# EAGLE schematic Welder_PSU (EAGLE 9.6.2), part 1 of 2

## Sheet 1 of 5
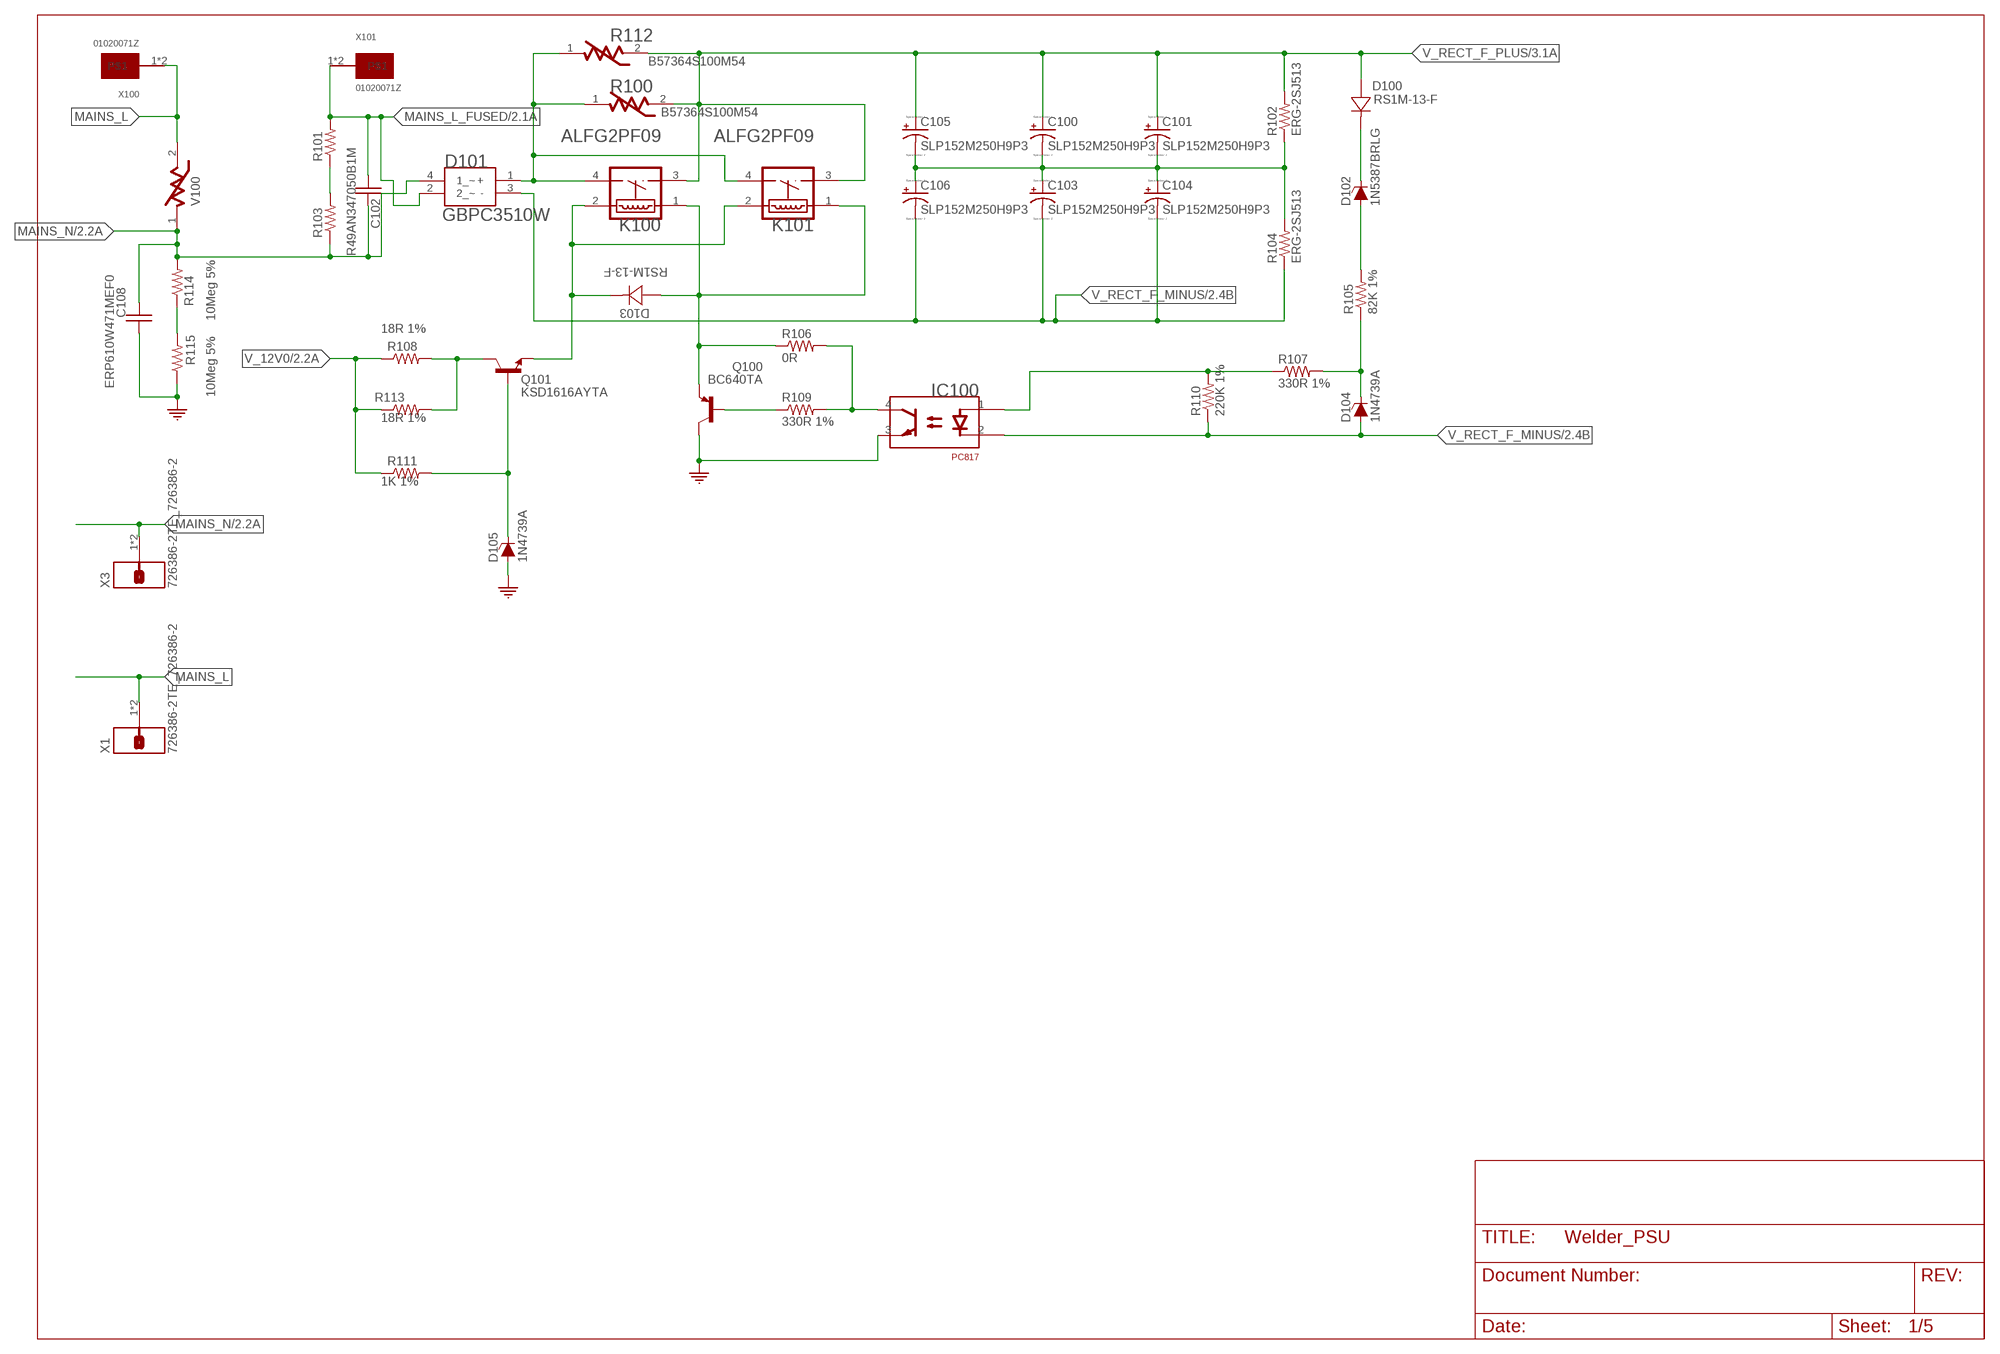
[diagram p0: schematic, sheet 1]

### Parts
C100  SLP152M250H9P3  [CAPACITOR-ELKO-400V-RM10-35X50]
C101  SLP152M250H9P3  [CAPACITOR-ELKO-400V-RM10-35X50]
C102  R49AN347050B1M  [R49AN347050B1M]
C103  SLP152M250H9P3  [CAPACITOR-ELKO-400V-RM10-35X50]
C104  SLP152M250H9P3  [CAPACITOR-ELKO-400V-RM10-35X50]
C105  SLP152M250H9P3  [CAPACITOR-ELKO-400V-RM10-35X50]
C106  SLP152M250H9P3  [CAPACITOR-ELKO-400V-RM10-35X50]
C108  ERP610W471MEF0  [CAPACITOR-FILM-RM12.5MM-12MM]
D100  RS1M-13-F  [SMA-DIODE]
D101  GBPC3510W  [GBPC3510W]
D102  1N5387BRLG  [DO-201AD]
D103  RS1M-13-F  [SMA-DIODE]
D104  1N4739A  [DO-201AD]
D105  1N4739A  [DO-201AD]
IC100  PC817  [DIP04]
K100  PANASONIC_ALFG2PF09PANASONIC_ALFG2PF09_0_0  [PANASONIC_ALFG2PF09_0]
K101  PANASONIC_ALFG2PF09PANASONIC_ALFG2PF09_0_0  [PANASONIC_ALFG2PF09_0]
Q100  BC640TA  [TO-92]
Q101  KSD1616AYTA  [TO-92]
R100  B57364S100M54  [VARISTOR_D25_P7.5]
R101  R_1206EIA1206  [EIA1206]
R102  ERG-2SJ513  [ERG-2S]
R103  R_1206EIA1206  [EIA1206]
R104  ERG-2SJ513  [ERG-2S]
R105  82K 1%  R_2010  [R2010]
R106  0R  R_0603  [EIA0603]
R107  330R 1%  R_0603  [EIA0603]
R108  R_2010EIA2010  [EIA2010]
R109  330R 1%  R_0603  [EIA0603]
R110  220K 1%  R_0603  [EIA0603]
R111  R_1206EIA1206  [EIA1206]
R112  B57364S100M54  [VARISTOR_D25_P7.5]
R113  R_2010EIA2010  [EIA2010]
R114  RNF12FTD10M0  [RES-RM12.5-VR37]
R115  RNF12FTD10M0  [RES-RM12.5-VR37]
V100  B72205S0271K101B72205S2131K101  [EPCOS_B72205S0271K101_0]
X1  726386-2TE_726386-2  [TE_726386-2]
X3  726386-2TE_726386-2  [TE_726386-2]
X100  01020071Z  [FUSE_CLIP_01020071Z]
X101  01020071Z  [FUSE_CLIP_01020071Z]

### Nets
GND [LV_Net]: C108.1 D105.A IC100.3(EMITTER) Q100.2(C) R115.1 ; also sheet 2,3,4,5
MAINS_L [L_Net]: V100.2 X1.1 X1.1-2 X100.1 X100.1-1
MAINS_L_FUSED [L_Net]: C102.2 D101.2(2_~) R101.2 X101.1 X101.1-1 ; also sheet 2
MAINS_N [N_Net]: C102.1 C108.2 D101.4(1_~) R103.1 R114.2 V100.1 X3.1 X3.1-2 ; also sheet 2
N$91 [MV_Net]: R114.1 R115.2
N$93 [HV_Net+]: D101.1(+) K100.4(COM) K101.4(COM) R100.1 R112.1
N$95 [LV_Net]: D103.C K100.2 K101.2 Q101.1(E)
N$96 [MV_Net]: R101.1 R103.2
N$97 [LV_Net]: D103.A K100.1 K101.1 Q100.1(E) R106.1
N$98 [LV_Net]: Q101.2(C) R108.2 R113.2
N$100 [LV_Net]: Q100.3(B) R109.1
N$101 [LV_Net]: D105.K(C) Q101.3(B) R111.2
N$102 [LV_Net]: IC100.4(COLLECTOR) R106.2 R109.2
N$104 [MV_Net]: C100.2(-) C101.2(-) C103.1(+) C104.1(+) C105.2(-) C106.1(+) R102.1 R104.2
N$106 [HV_Net-]: D104.K(C) R105.1 R107.2
N$108 [MV_Net]: D102.A R105.2
N$109 [HV_Net+]: D100.C D102.K(C)
N$110 [HV_Net-]: IC100.1(ANODE) R107.1 R110.2
V_12V0 [LV_Net]: R108.1 R111.1 R113.1 ; also sheet 2,3
V_RECT_F_MINUS [HV_Net-]: C103.2(-) C104.2(-) C106.2(-) D101.3(-) D104.A IC100.2(CATHODE) R104.1 R110.1 ; also sheet 2,3
V_RECT_F_PLUS [HV_Net+]: C100.1(+) C101.1(+) C105.1(+) D100.A K100.3(NO) K101.3(NO) R100.2 R102.2 R112.2 ; also sheet 3

## Sheet 2 of 5
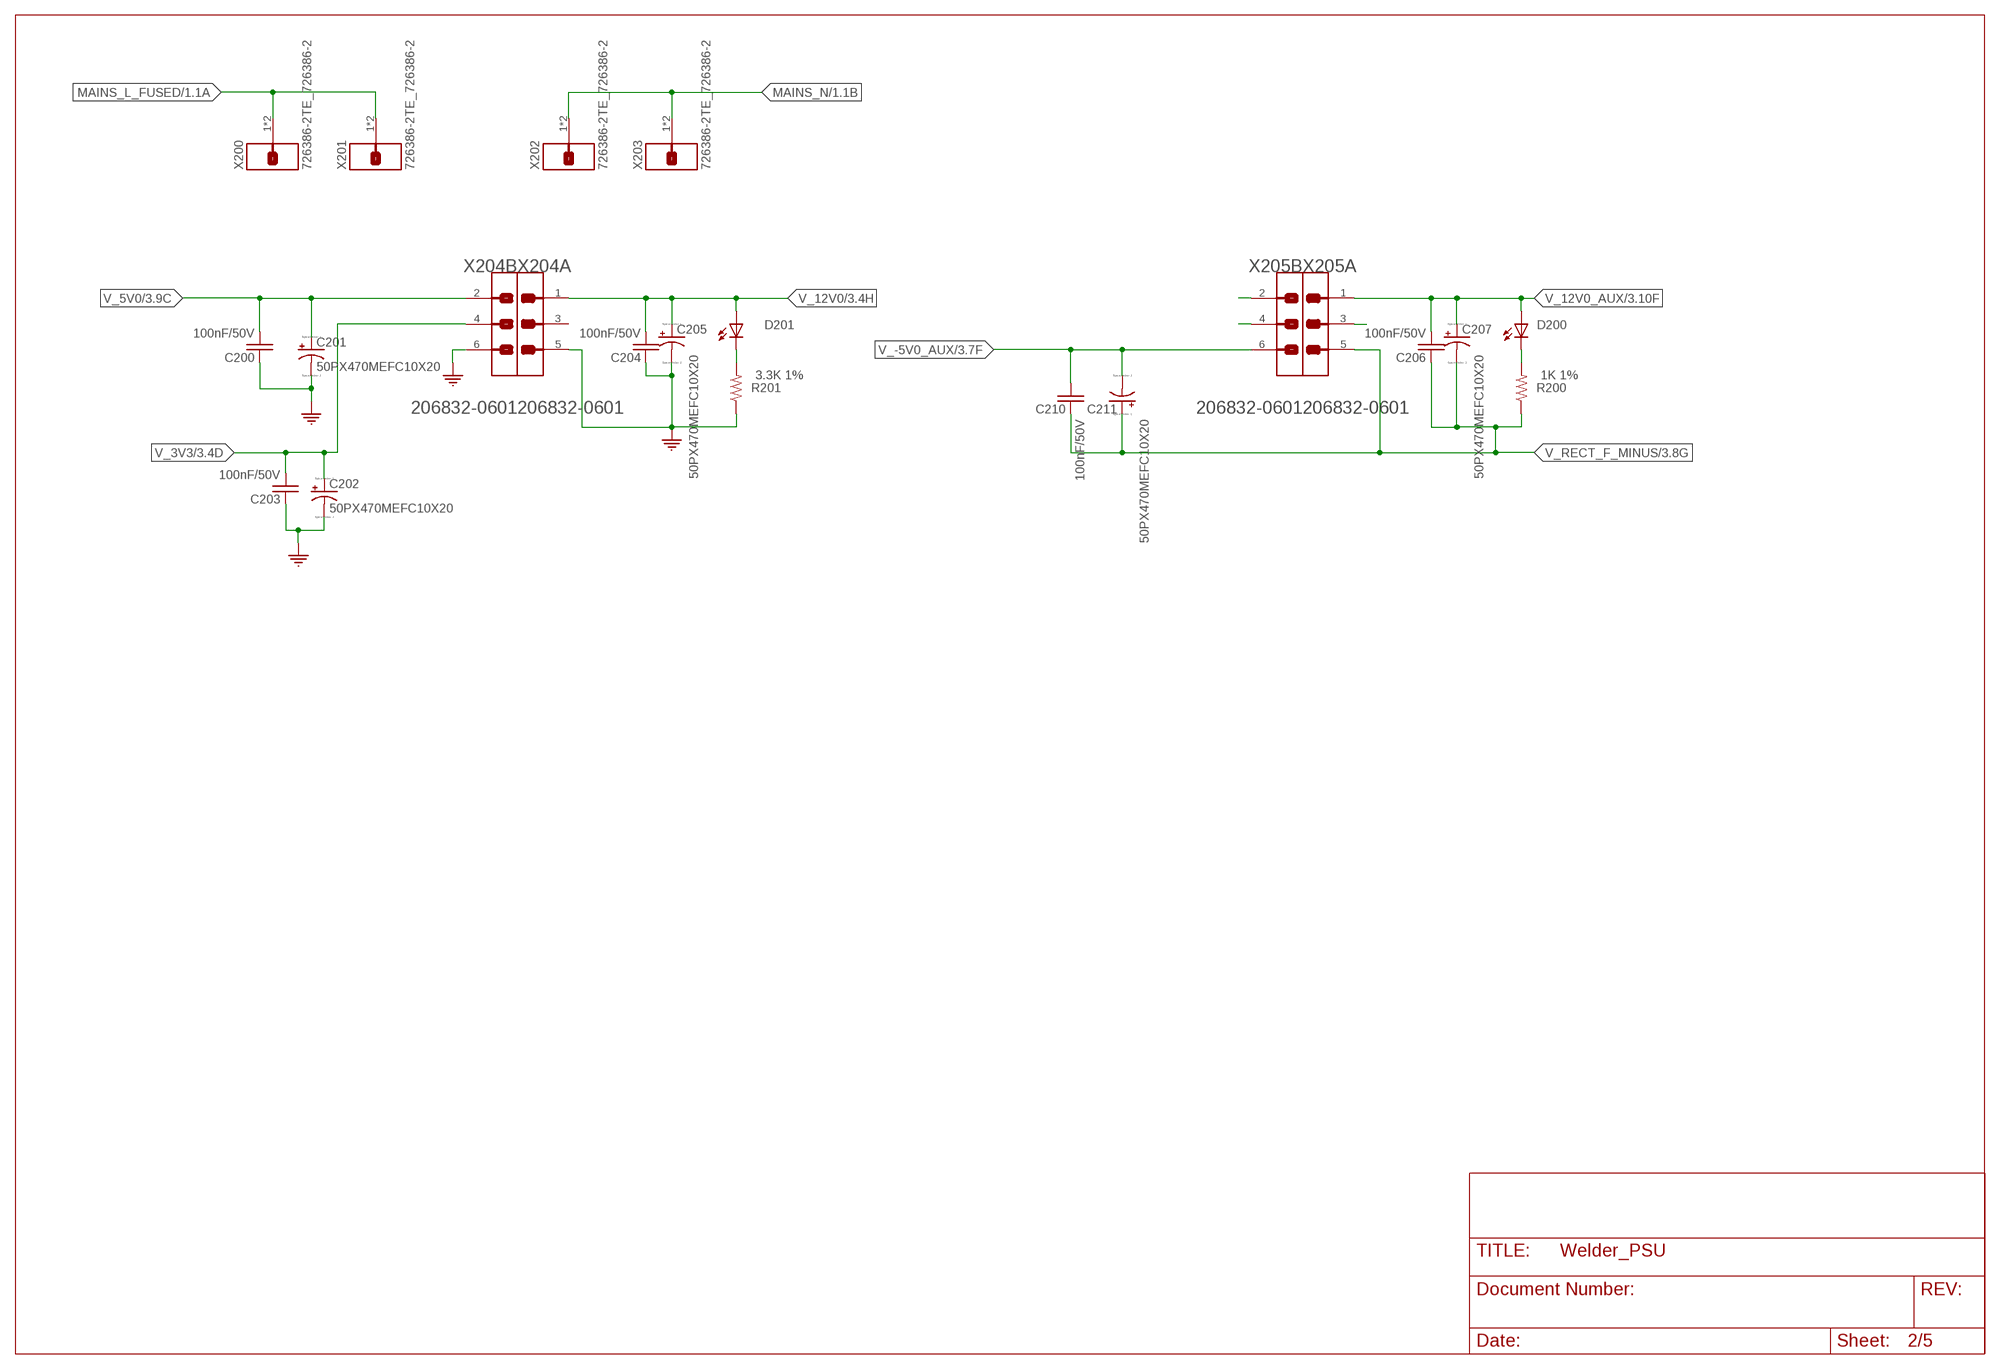
[diagram p1: schematic, sheet 2]

### Parts
C200  100nF/50V  C_0603EIA0603  [EIA0603]
C201  50PX470MEFC10X20  [CAPACITOR-ELKO-RM5-10X16]
C202  50PX470MEFC10X20  [CAPACITOR-ELKO-RM5-10X16]
C203  100nF/50V  C_0603EIA0603  [EIA0603]
C204  100nF/50V  C_0603EIA0603  [EIA0603]
C205  50PX470MEFC10X20  [CAPACITOR-ELKO-RM5-10X16]
C206  100nF/50V  C_0603EIA0603  [EIA0603]
C207  50PX470MEFC10X20  [CAPACITOR-ELKO-RM5-10X16]
C210  100nF/50V  C_0603EIA0603  [EIA0603]
C211  50PX470MEFC10X20  [CAPACITOR-ELKO-RM5-10X16]
D200  26-21/GPC-F3138B/CA  [SMD1206-LED]
D201  26-21/GPC-F3138B/CA  [SMD1206-LED]
R200  1K 1%  R_0603  [EIA0603]
R201  3.3K 1%  R_0603  [EIA0603]
X200  726386-2TE_726386-2  [TE_726386-2]
X201  726386-2TE_726386-2  [TE_726386-2]
X202  726386-2TE_726386-2  [TE_726386-2]
X203  726386-2TE_726386-2  [TE_726386-2]
X204  MOLEX_206832-0601MOLEX_206832-0601  [MOLEX_206832-0601]
X205  MOLEX_206832-0601MOLEX_206832-0601  [MOLEX_206832-0601]

### Nets
GND [LV_Net]: C200.1 C201.2(-) C202.2(-) C203.1 C204.1 C205.2(-) R201.1 X204.5 X204.6 ; also sheet 1,3,4,5
MAINS_L_FUSED [L_Net]: X200.1 X200.1-2 X201.1 X201.1-2 ; also sheet 1
MAINS_N [N_Net]: X202.1 X202.1-2 X203.1 X203.1-2 ; also sheet 1
N$11: D201.2(C) R201.2
N$42 [HV_Net-]: X205.2
N$67 [HV_Net-]: X205.4
N$107 [HV_Net-]: D200.2(C) R200.2
N$112 [HV_Net-]: X205.3
V_3V3 [LV_Net]: C202.1(+) C203.2 X204.4 ; also sheet 3,4,5
V_5V0 [LV_Net]: C200.2 C201.1(+) X204.2 ; also sheet 3,5
V_12V0 [LV_Net]: C204.2 C205.1(+) D201.1(A) X204.1 ; also sheet 1,3
V_12V0_AUX [HV_Net-]: C206.2 C207.1(+) D200.1(A) X205.1 ; also sheet 3
V_-5V0_AUX [HV_Net-]: C210.2 C211.2(-) X205.6 ; also sheet 3
V_RECT_F_MINUS [HV_Net-]: C206.1 C207.2(-) C210.1 C211.1(+) R200.1 X205.5 ; also sheet 1,3
Unconnected: X204.3

## Sheet 3 of 5
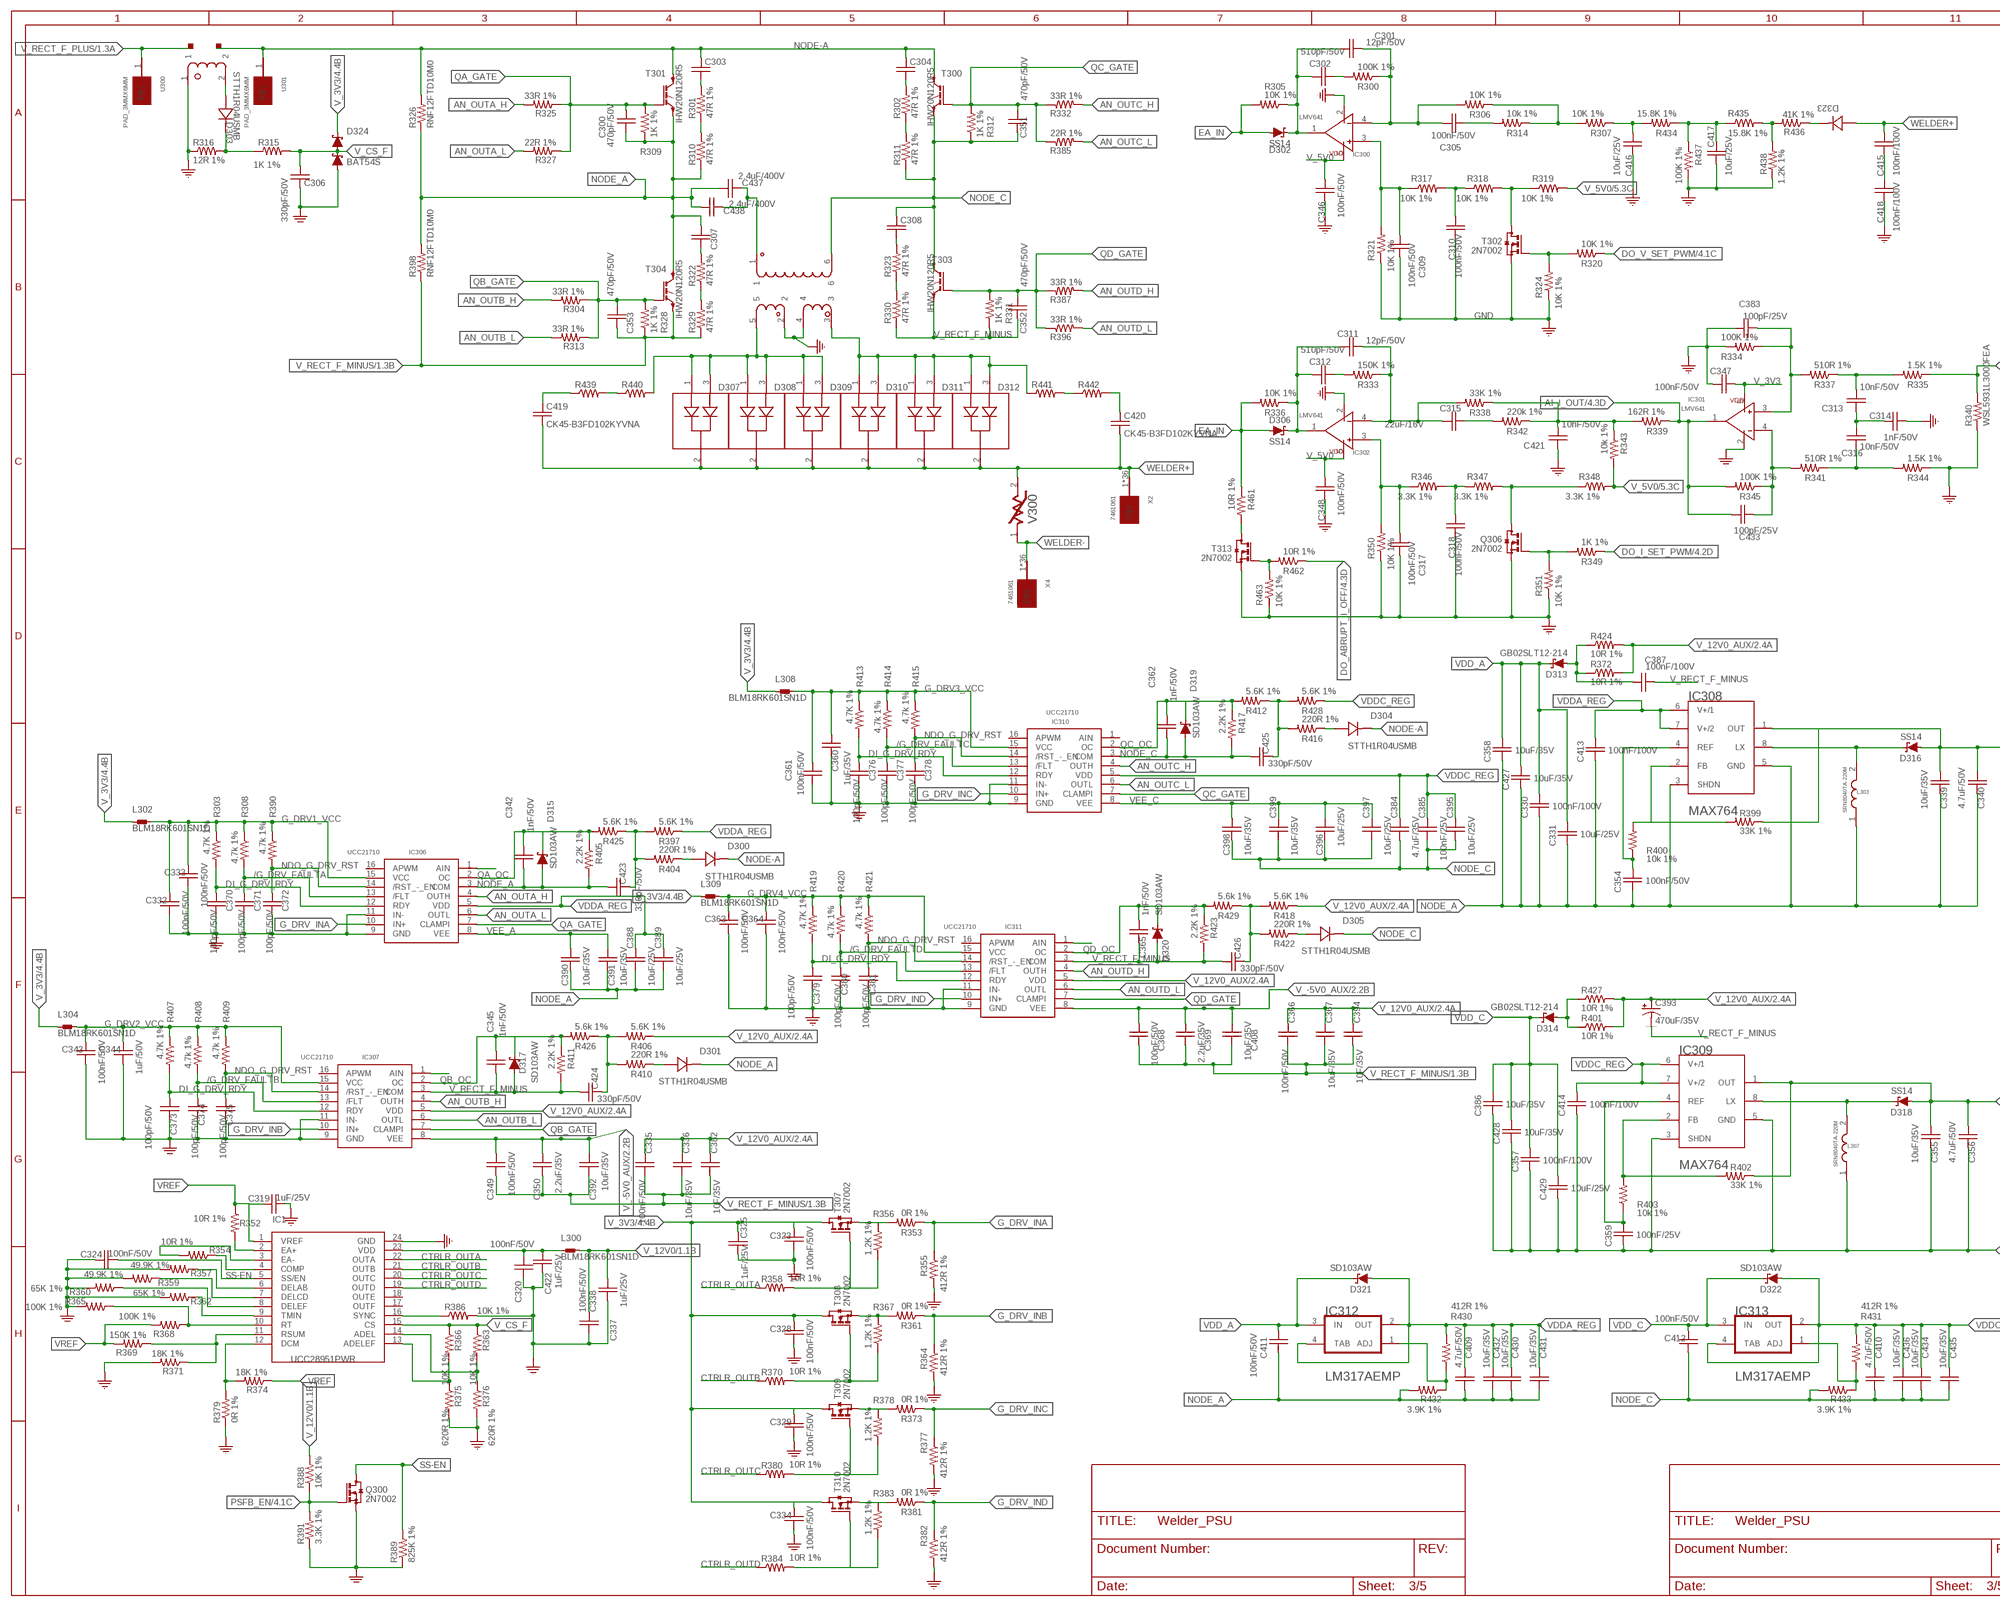
[diagram p2: schematic, sheet 3, part 1 of 2]
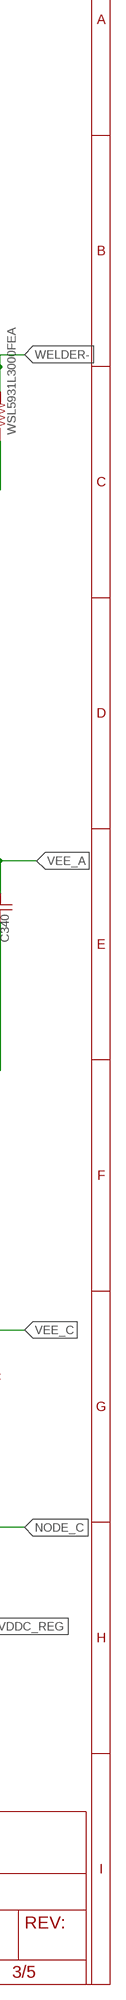
[diagram p3: schematic, sheet 3, part 2 of 2]

### Parts
C300  470pF/50V  C_0603EIA0603  [EIA0603]
C301  12pF/50V  C_0603EIA0603  [EIA0603]
C302  510pF/50V  C_0603EIA0603  [EIA0603]
C303  HVCC153Y6P471MEAX  [CAPACITOR-FILM-RM12.5MM-12MM]
C304  HVCC153Y6P471MEAX  [CAPACITOR-FILM-RM12.5MM-12MM]
C305  100nF/50V  C_0603EIA0603  [EIA0603]
C306  330pF/50V  C_0603EIA0603  [EIA0603]
C307  HVCC153Y6P471MEAX  [CAPACITOR-FILM-RM12.5MM-12MM]
C308  HVCC153Y6P471MEAX  [CAPACITOR-FILM-RM12.5MM-12MM]
C309  100nF/50V  C_0603EIA0603  [EIA0603]
C310  100nF/50V  C_0603EIA0603  [EIA0603]
C311  12pF/50V  C_0603EIA0603  [EIA0603]
C312  510pF/50V  C_0603EIA0603  [EIA0603]
C313  10nF/50V  C_0603EIA0603  [EIA0603]
C314  1nF/50V  C_0603EIA0603  [EIA0603]
C315  22uF/16V  C_0603EIA0603  [EIA0603]
C316  10nF/50V  C_0603EIA0603  [EIA0603]
C317  100nF/50V  C_0603EIA0603  [EIA0603]
C318  100nF/50V  C_0603EIA0603  [EIA0603]
C319  1uF/25V  C_0603EIA0603  [EIA0603]
C320  100nF/50V  C_0603EIA0603  [EIA0603]
C323  100nF/50V  C_0603EIA0603  [EIA0603]
C324  100nF/50V  C_0603EIA0603  [EIA0603]
C325  1uF/25V  C_0603EIA0603  [EIA0603]
C328  100nF/50V  C_0603EIA0603  [EIA0603]
C329  100nF/50V  C_0603EIA0603  [EIA0603]
C330  100nF/100V  C_0603EIA0603  [EIA0603]
C331  10uF/25V  C_0603EIA0603  [EIA0603]
C332  100nF/50V  C_0603EIA0603  [EIA0603]
C333  100nF/50V  C_0603EIA0603  [EIA0603]
C334  100nF/50V  C_0603EIA0603  [EIA0603]
C335  100nF/50V  C_0603EIA0603  [EIA0603]
C336  10uF/35V  C_0603EIA0603  [EIA0603]
C337  1uF/25V  C_0603EIA0603  [EIA0603]
C338  100nF/50V  C_0603EIA0603  [EIA0603]
C339  10uF/35V  C_0603EIA0603  [EIA0603]
C340  4.7uF/50V  C_0603EIA0603  [EIA0603]
C342  1nF/50V  C_0603EIA0603  [EIA0603]
C343  100nF/50V  C_0603EIA0603  [EIA0603]
C344  1uF/50V  C_0603EIA0603  [EIA0603]
C345  1nF/50V  C_0603EIA0603  [EIA0603]
C346  100nF/50V  C_0603EIA0603  [EIA0603]
C347  100nF/50V  C_0603EIA0603  [EIA0603]
C348  100nF/50V  C_0603EIA0603  [EIA0603]
C349  100nF/50V  C_0603EIA0603  [EIA0603]
C350  2.2uF/35V  C_0603EIA0603  [EIA0603]
C351  470pF/50V  C_0603EIA0603  [EIA0603]
C352  470pF/50V  C_0603EIA0603  [EIA0603]
C353  470pF/50V  C_0603EIA0603  [EIA0603]
C354  100nF/50V  C_0603EIA0603  [EIA0603]
C355  10uF/35V  C_0603EIA0603  [EIA0603]
C356  4.7uF/50V  C_0603EIA0603  [EIA0603]
C357  100nF/100V  C_0603EIA0603  [EIA0603]
C358  10uF/35V  C_0603EIA0603  [EIA0603]
C359  100nF/25V  C_0603EIA0603  [EIA0603]
C360  1uF/35V  C_0603EIA0603  [EIA0603]
C361  100nF/50V  C_0603EIA0603  [EIA0603]
C362  1nF/50V  C_0603EIA0603  [EIA0603]
C363  100nF/50V  C_0603EIA0603  [EIA0603]
C364  100nF/50V  C_0603EIA0603  [EIA0603]
C365  1nF/50V  C_0603EIA0603  [EIA0603]
C366  100nF/50V  C_0603EIA0603  [EIA0603]
C367  10uF/35V  C_0603EIA0603  [EIA0603]
C368  100nF/50V  C_0603EIA0603  [EIA0603]
C369  2.2uF/35V  C_0603EIA0603  [EIA0603]
C370  100pF/50V  C_0603EIA0603  [EIA0603]
C371  100pF/50V  C_0603EIA0603  [EIA0603]
C372  100pF/50V  C_0603EIA0603  [EIA0603]
C373  100pF/50V  C_0603EIA0603  [EIA0603]
C374  100pF/50V  C_0603EIA0603  [EIA0603]
C375  100pF/50V  C_0603EIA0603  [EIA0603]
C376  100pF/50V  C_0603EIA0603  [EIA0603]
C377  100pF/50V  C_0603EIA0603  [EIA0603]
C378  100pF/50V  C_0603EIA0603  [EIA0603]
C379  100pF/50V  C_0603EIA0603  [EIA0603]
C380  100pF/50V  C_0603EIA0603  [EIA0603]
C381  100pF/50V  C_0603EIA0603  [EIA0603]
C382  10F/35V  C_0603EIA0603  [EIA0603]
C383  100pF/25V  C_0603EIA0603  [EIA0603]
C384  4.7uF/35V  C_0603EIA0603  [EIA0603]
C385  100nF/25V  C_0603EIA0603  [EIA0603]
C386  10uF/35V  C_0603EIA0603  [EIA0603]
C387  100nF/100V  C_0603EIA0603  [EIA0603]
C388  10uF/25V  C_0603EIA0603  [EIA0603]
C389  10uF/25V  C_0603EIA0603  [EIA0603]
C390  10uF/35V  C_0603EIA0603  [EIA0603]
C391  10uF/35V  C_0603EIA0603  [EIA0603]
C392  10uF/35V  C_0603EIA0603  [EIA0603]
C393  470uF/35V  50PX470MEFC10X20  [CAPACITOR-ELKO-RM5-10X16]
C394  10F/35V  C_0603EIA0603  [EIA0603]
C395  10uF/25V  C_0603EIA0603  [EIA0603]
C396  10uF/25V  C_0603EIA0603  [EIA0603]
C397  10uF/25V  C_0603EIA0603  [EIA0603]
C398  10uF/35V  C_0603EIA0603  [EIA0603]
C399  10uF/35V  C_0603EIA0603  [EIA0603]
C408  10uF/35V  C_0603EIA0603  [EIA0603]
C409  4.7uF/50V  C_0603EIA0603  [EIA0603]
C410  4.7uF/50V  C_0603EIA0603  [EIA0603]
C411  100nF/50V  C_0603EIA0603  [EIA0603]
C412  100nF/50V  C_0603EIA0603  [EIA0603]
C413  100nF/100V  C_0603EIA0603  [EIA0603]
C414  100nF/100V  C_0603EIA0603  [EIA0603]
C415  100nF/100V  C_0603EIA0603  [EIA0603]
C416  10uF/25V  C_0603EIA0603  [EIA0603]
C417  10uF/25V  C_0603EIA0603  [EIA0603]
C418  100nF/100V  C_0603EIA0603  [EIA0603]
C419  CK45-B3FD102KYVNA  [C_DISC_P7.5D12]
C420  CK45-B3FD102KYVNA  [C_DISC_P7.5D12]
C421  10nF/50V  C_0603EIA0603  [EIA0603]
C422  1uF/25V  C_0603EIA0603  [EIA0603]
C423  330pF/50V  C_0603EIA0603  [EIA0603]
C424  330pF/50V  C_0603EIA0603  [EIA0603]
C425  330pF/50V  C_0603EIA0603  [EIA0603]
C426  330pF/50V  C_0603EIA0603  [EIA0603]
C427  10uF/35V  C_0603EIA0603  [EIA0603]
C428  10uF/35V  C_0603EIA0603  [EIA0603]
C429  10uF/25V  C_0603EIA0603  [EIA0603]
C430  10uF/35V  C_0603EIA0603  [EIA0603]
C431  10uF/35V  C_0603EIA0603  [EIA0603]
C432  10uF/35V  C_0603EIA0603  [EIA0603]
C433  100pF/25V  C_0603EIA0603  [EIA0603]
C434  10uF/35V  C_0603EIA0603  [EIA0603]
C435  10uF/35V  C_0603EIA0603  [EIA0603]
C436  10uF/35V  C_0603EIA0603  [EIA0603]
C437  ECW-F4245JLB  [CAPACITOR-FILM-RM17.5-28X17.5X25]
C438  ECW-F4245JLB  [CAPACITOR-FILM-RM17.5-28X17.5X25]
D300  STTH1R04USMB  [SMB]
D301  STTH1R04USMB  [SMB]
D302  SS14  [SMA]
D303  STTH1R04USMB  [SMB]
D304  STTH1R04USMB  [SMB]
D305  STTH1R04USMB  [SMB]
D306  SS14  [SMA]
D307  FEP30DP-E3/45TO-247AD  [TO-247AD]
D308  FEP30DP-E3/45TO-247AD  [TO-247AD]
D309  FEP30DP-E3/45TO-247AD  [TO-247AD]
D310  FEP30DP-E3/45TO-247AD  [TO-247AD]
D311  FEP30DP-E3/45TO-247AD  [TO-247AD]
D312  FEP30DP-E3/45TO-247AD  [TO-247AD]
D313  GB02SLT12-214  [SMB]
D314  GB02SLT12-214  [SMB]
D315  SD103AW  [SOD-323]
D316  SS14  [SMA]
D317  SD103AW  [SOD-323]
D318  SS14  [SMA]
D319  SD103AW  [SOD-323]
D320  SD103AW  [SOD-323]
D321  SD103AW  [SOD-323]
D322  SD103AW  [SOD-323]
D323  STTH1R04USMB  [SMB]
D324  BAT54S  [SOT23DUALDIODE]
IC1  UCC28951PWR  [TSSOP24]
IC300  LMV641  [SOT-23-5]
IC301  LMV641  [SOT-23-5]
IC302  LMV641  [SOT-23-5]
IC306  UCC21710  [SOIC16_WIDE_HV]
IC307  UCC21710  [SOIC16_WIDE_HV]
IC308  MAX764CSA+  [SOIC8]
IC309  MAX764CSA+  [SOIC8]
IC310  UCC21710  [SOIC16_WIDE_HV]
IC311  UCC21710  [SOIC16_WIDE_HV]
IC312  LM317AEMP  [SOT223_LM317AEMP]
IC313  LM317AEMP  [SOT223_LM317AEMP]
L300  BLM18RK601SN1D  [0603]
L302  BLM18RK601SN1D  [0603]
L303  SRN8040TA-220M  [SRN8040TA-220M]
L304  BLM18RK601SN1D  [0603]
L307  SRN8040TA-220M  [SRN8040TA-220M]
L308  BLM18RK601SN1D  [0603]
L309  BLM18RK601SN1D  [0603]
Q300  2N7002  [SOT23]
Q306  2N7002  [SOT23]
R300  100K 1%  R_0603  [EIA0603]
R301  47R 1%  R-US_R2512  [R2512]
R302  47R 1%  R-US_R2512  [R2512]
R303  4.7K 1%  R_0603  [EIA0603]
R304  33R 1%  R_2010EIA2010  [EIA2010]
R305  10K 1%  R_0603  [EIA0603]
R306  10K 1%  R_0603  [EIA0603]
R307  10K 1%  R_0603  [EIA0603]
R308  4.7k 1%  R_0603  [EIA0603]
R309  1K 1%  R_2010EIA2010  [EIA2010]
R310  47R 1%  R-US_R2512  [R2512]
R311  47R 1%  R-US_R2512  [R2512]
R312  1K 1%  R_2010EIA2010  [EIA2010]
R313  33R 1%  R_2010EIA2010  [EIA2010]
R314  10k 1%  R_0603  [EIA0603]
R315  1K 1%  R_0603  [EIA0603]
R316  12R 1%  R_2512  [EIA2512]
R317  10K 1%  R_0603  [EIA0603]
R318  10K 1%  R_0603  [EIA0603]
R319  10K 1%  R_0603  [EIA0603]
R320  10K 1%  R_0603  [EIA0603]
R321  10K 1%  R_0603  [EIA0603]
R322  47R 1%  R-US_R2512  [R2512]
R323  47R 1%  R-US_R2512  [R2512]
R324  10K 1%  R_0603  [EIA0603]
R325  33R 1%  R_2010EIA2010  [EIA2010]
R326  RNF12FTD10M0  [RES-RM12.5-VR37]
R327  22R 1%  R_2010EIA2010  [EIA2010]
R328  1K 1%  R_2010EIA2010  [EIA2010]
R329  47R 1%  R-US_R2512  [R2512]
R330  47R 1%  R-US_R2512  [R2512]
R331  1K 1%  R_2010EIA2010  [EIA2010]
R332  33R 1%  R_2010EIA2010  [EIA2010]
R333  150K 1%  R_0603  [EIA0603]
R334  100K 1%  R_0603  [EIA0603]
R335  1.5K 1%  R_0603  [EIA0603]
R336  10K 1%  R_0603  [EIA0603]
R337  510R 1%  R_0603  [EIA0603]
R338  33K 1%  R_0603  [EIA0603]
R339  162R 1%  R_0603  [EIA0603]
R340  WSL5931L3000FEA  [WSLP3921]
R341  510R 1%  R_0603  [EIA0603]
R342  220k 1%  R_0603  [EIA0603]
R343  10k 1%  R_0603  [EIA0603]
R344  1.5K 1%  R_0603  [EIA0603]
R345  100K 1%  R_0603  [EIA0603]
R346  3.3K 1%  R_0603  [EIA0603]
R347  3.3K 1%  R_0603  [EIA0603]
R348  3.3K 1%  R_0603  [EIA0603]
R349  1K 1%  R_0603  [EIA0603]
R350  10K 1%  R_0603  [EIA0603]
R351  10K 1%  R_0603  [EIA0603]
R352  10R 1%  R_0603  [EIA0603]
R353  0R 1%  R_0603  [EIA0603]
R354  10R 1%  R_0603  [EIA0603]
R355  412R 1%  R_0603  [EIA0603]
R356  1.2K 1%  R_0603  [EIA0603]
R357  49.9K 1%  R_0603  [EIA0603]
R358  10R 1%  R_0603  [EIA0603]
R359  49.9K 1%  R_0603  [EIA0603]
R360  65K 1%  R_0603  [EIA0603]
R361  0R 1%  R_0603  [EIA0603]
R362  65K 1%  R_0603  [EIA0603]
R363  10K 1%  R_0603  [EIA0603]
R364  412R 1%  R_0603  [EIA0603]
R365  100K 1%  R_0603  [EIA0603]
R366  10K 1%  R_0603  [EIA0603]
R367  1.2K 1%  R_0603  [EIA0603]
R368  100K 1%  R_0603  [EIA0603]
R369  150K 1%  R_0603  [EIA0603]
R370  10R 1%  R_0603  [EIA0603]
R371  18K 1%  R_0603  [EIA0603]
R372  10R 1%  R_2512  [EIA2512]
R373  0R 1%  R_0603  [EIA0603]
R374  18K 1%  R_0603  [EIA0603]
R375  620R 1%  R_0603  [EIA0603]
R376  620R 1%  R_0603  [EIA0603]
R377  412R 1%  R_0603  [EIA0603]
R378  1.2K 1%  R_0603  [EIA0603]
R379  0R 1%  R_0603  [EIA0603]
R380  10R 1%  R_0603  [EIA0603]
R381  0R 1%  R_0603  [EIA0603]
R382  412R 1%  R_0603  [EIA0603]
R383  1.2K 1%  R_0603  [EIA0603]
R384  10R 1%  R_0603  [EIA0603]
R385  22R 1%  R_2010EIA2010  [EIA2010]
R386  10K 1%  R_0603  [EIA0603]
R387  33R 1%  R_2010EIA2010  [EIA2010]
R388  10K 1%  R_0603  [EIA0603]
R389  825K 1%  R_0603  [EIA0603]
R390  4.7k 1%  R_0603  [EIA0603]
R391  3.3K 1%  R_0603  [EIA0603]
R396  33R 1%  R_2010EIA2010  [EIA2010]
R397  5.6K 1%  R_0603  [EIA0603]
R398  RNF12FTD10M0  [RES-RM12.5-VR37]
R399  33K 1%  R_0603  [EIA0603]
R400  10k 1%  R_0603  [EIA0603]
R401  10R 1%  R_2512  [EIA2512]
R402  33K 1%  R_0603  [EIA0603]
R403  10k 1%  R_0603  [EIA0603]
R404  220R 1%  R_0603  [EIA0603]
R405  2.2K 1%  R_0603  [EIA0603]
R406  5.6K 1%  R_0603  [EIA0603]
R407  4.7K 1%  R_0603  [EIA0603]
R408  4.7k 1%  R_0603  [EIA0603]
R409  4.7k 1%  R_0603  [EIA0603]
R410  220R 1%  R_0603  [EIA0603]
R411  2.2K 1%  R_0603  [EIA0603]
R412  5.6K 1%  R_0603  [EIA0603]
R413  4.7K 1%  R_0603  [EIA0603]
R414  4.7k 1%  R_0603  [EIA0603]
R415  4.7k 1%  R_0603  [EIA0603]
R416  220R 1%  R_0603  [EIA0603]
R417  2.2K 1%  R_0603  [EIA0603]
R418  5.6K 1%  R_0603  [EIA0603]
R419  4.7K 1%  R_0603  [EIA0603]
R420  4.7k 1%  R_0603  [EIA0603]
R421  4.7k 1%  R_0603  [EIA0603]
R422  220R 1%  R_0603  [EIA0603]
R423  2.2K 1%  R_0603  [EIA0603]
R424  10R 1%  R_2512  [EIA2512]
R425  5.6K 1%  R_0603  [EIA0603]
R426  5.6k 1%  R_0603  [EIA0603]
R427  10R 1%  R_2512  [EIA2512]
R428  5.6K 1%  R_0603  [EIA0603]
R429  5.6k 1%  R_0603  [EIA0603]
R430  412R 1%  R_0603  [EIA0603]
R431  412R 1%  R_0603  [EIA0603]
R432  3.9K 1%  R_0603  [EIA0603]
R433  3.9K 1%  R_0603  [EIA0603]
R434  15.8K 1%  R_0603  [EIA0603]
R435  15.8K 1%  R_0603  [EIA0603]
R436  41K 1%  R_2010EIA2010  [EIA2010]
R437  100K 1%  R_0603  [EIA0603]
R438  1.2K 1%  R_2010EIA2010  [EIA2010]
R439  RR02J22RTB  [RES-RM15-RSF1W]
R440  RR02J22RTB  [RES-RM15-RSF1W]
R441  RR02J22RTB  [RES-RM15-RSF1W]
R442  RR02J22RTB  [RES-RM15-RSF1W]
R461  10R 1%  R_0603  [EIA0603]
R462  10R 1%  R_0603  [EIA0603]
R463  10K 1%  R_0603  [EIA0603]
T300  IHW20N120R5  [TO-247AC]
T301  IHW20N120R5  [TO-247AC]
T302  2N7002  [SOT23]
T303  IHW20N120R5  [TO-247AC]
T304  IHW20N120R5  [TO-247AC]
T307  2N7002  [SOT23]
T308  2N7002  [SOT23]
T309  2N7002  [SOT23]
T310  2N7002  [SOT23]
T313  2N7002  [SOT23]
TR300  CST206-2A  [CST206-2A]
TR305  11-0060-A  [11-0060-A]
U300  PAD_3MMX6MM  [PAD-3.0X6.0MM]
U301  PAD_3MMX6MM  [PAD-3.0X6.0MM]
V300  B72205S0271K101B72205S2131K101  [EPCOS_B72205S0271K101_0]
X2  7461061  [X01_M10_7461061]
X4  7461061  [X01_M10_7461061]

### Nets
/G_DRV_FAULTA: C371.2 IC306.13(/FLT) R308.2 ; also sheet 4
/G_DRV_FAULTB: C374.2 IC307.13(/FLT) R408.2 ; also sheet 4
/G_DRV_FAULTC: C377.2 IC310.13(/FLT) R414.2 ; also sheet 4
/G_DRV_FAULTD: C380.2 IC311.13(/FLT) R420.2 ; also sheet 4
AI_I_OUT: C433.2 IC301.1(OUT) R339.1 R345.2 ; also sheet 4
AN_OUTA_H [MV_Net]: IC306.4(OUTH) R325.2
AN_OUTA_L [MV_Net]: IC306.6(OUTL) R327.2
AN_OUTB_H [HV_Net-]: IC307.4(OUTH) R304.2
AN_OUTB_L [HV_Net-]: IC307.6(OUTL) R313.2
AN_OUTC_H [MV_Net]: IC310.4(OUTH) R332.2
AN_OUTC_L [MV_Net]: IC310.6(OUTL) R385.2
AN_OUTD_H [HV_Net-]: IC311.4(OUTH) R387.2
AN_OUTD_L [HV_Net-]: IC311.6(OUTL) R396.2
CTRLR_OUTA [LV_Net]: IC1.22(OUTA) R358.1
CTRLR_OUTB [LV_Net]: IC1.21(OUTB) R370.1
CTRLR_OUTC [LV_Net]: IC1.20(OUTC) R380.1
CTRLR_OUTD [LV_Net]: IC1.19(OUTD) R384.1
DI_G_DRV_RDY [LV_Net]: C370.2 C373.2 C376.2 C379.2 IC306.12(RDY) IC307.12(RDY) IC310.12(RDY) IC311.12(RDY) R303.2 R407.2 R413.2 R419.2 ; also sheet 4
DO_ABRUPT_I_OFF: R462.1 ; also sheet 4
DO_I_SET_PWM: R349.1 ; also sheet 4
DO_V_SET_PWM: R320.1 ; also sheet 4
EA_IN: D302.2(A) D306.2(A) R305.2 R336.2 R461.1
G_DRV1_VCC: C332.2 C333.2 IC306.15(VCC) L302.2 R303.1 R308.1 R390.1
G_DRV2_VCC: C343.2 C344.2 IC307.15(VCC) L304.2 R407.1 R408.1 R409.1
G_DRV3_VCC: C360.2 C361.2 IC310.15(VCC) L308.2 R413.1 R414.1 R415.1
G_DRV4_VCC: C363.2 C364.2 IC311.15(VCC) L309.2 R419.1 R420.1 R421.1
G_DRV_INA [LV_Net]: IC306.10(IN+) R353.1 R355.1
G_DRV_INB [LV_Net]: IC307.10(IN+) R361.1 R364.1
G_DRV_INC [LV_Net]: IC310.10(IN+) R373.1 R377.1
G_DRV_IND [LV_Net]: IC311.10(IN+) R381.1 R382.1
GND [LV_Net]: C306.1 C309.2 C310.2 C314.2 C317.2 C318.2 C319.2 C320.1 C323.1 C324.1 C325.2 C328.1 C329.1 C332.1 C333.1 C334.1 C337.2 C338.1 C343.1 C344.1 C346.2 C347.2 C348.2 C360.1 C361.1 C363.1 C364.1 C370.1 C371.1 C372.1 C373.1 C374.1 C375.1 C376.1 C377.1 C378.1 C379.1 C380.1 C381.1 C383.1 C416.2 C417.2 C418.2 C421.1 C422.2 D324.1(A1) IC1.24(GND) IC300.2(VEE) IC301.2(VEE) IC302.2(VEE) IC306.9(GND) IC306.11(IN-) IC307.9(GND) IC307.11(IN-) IC310.9(GND) IC310.11(IN-) IC311.9(GND) IC311.11(IN-) Q300.2(S) Q306.2(S) R316.1 R321.1 R324.1 R334.2 R340.1 R344.1 R350.1 R351.1 R355.2 R357.2 R359.2 R360.2 R362.2 R364.2 R365.2 R371.2 R375.2 R376.2 R377.2 R379.1 R382.2 R386.2 R389.1 R391.1 R437.2 R438.1 R463.1 T302.2(S) T313.2(S) TR300.1 TR305.2 TR305.4 ; also sheet 1,2,4,5
N$1: C311.1 C315.2 IC302.4(IN-) R333.1 R338.2
N$2: IC1.12(DCM) R374.2 R379.2
N$3: IC1.11(RSUM) R369.1 R371.1
N$4: IC1.10(RT) R365.1 R368.1
N$5: IC1.9(TMIN) R362.1
N$6: IC1.8(DELEF) R360.1
N$7: IC1.6(DELAB) R357.1
N$8: IC1.7(DELCD) R359.1
N$9: IC1.4(COMP) R354.1
N$10: IC1.3(EA-) R354.2
N$12: IC1.2(EA+) R352.2
N$13: C320.2 C422.1 IC1.23(VDD) L300.1
N$14: IC1.16(SYNC) R386.1
N$15: D303.K(C) R315.1 R316.2
N$16: R356.1 R358.2 T307.1(G)
N$17: IC1.13(ADELEF) R366.2 R375.1
N$18: R353.2 R356.2 T307.2(S)
N$19: IC1.14(ADEL) R363.2 R376.1
N$20: C421.2 R338.1 R339.2 R342.1 R343.1
N$21: D303.A TR300.2
N$22: R378.1 R380.2 T309.1(G)
N$23: R373.2 R378.2 T309.2(S)
N$24: C313.2 R335.2 R337.1
N$25: C313.1 C314.1 C316.2
N$26: C316.1 R341.1 R344.2
N$27: R367.1 R370.2 T308.1(G)
N$28: R361.2 R367.2 T308.2(S)
N$29 [HV_Net-]: R323.1 R330.2
N$30: C433.1 IC301.4(IN-) R341.2 R345.1
N$31: Q306.1(G) R349.2 R351.2
N$32: C383.2 IC301.3(IN+) R334.1 R337.2
N$33: R383.1 R384.2 T310.1(G)
N$34 [MV_Net]: R301.1 R310.2
N$35: R381.2 R383.2 T310.2(S)
N$36 [MV_Net]: C303.2 R301.2
N$37: C315.1 R342.2
N$38: R462.2 R463.2 T313.1(G)
N$39: Q306.3(D) R347.2 R348.1
N$40 [MV_Net]: R302.1 R311.2
N$41 [MV_Net]: C304.2 R302.2
N$43 [MV_Net]: R322.1 R329.2
N$44 [MV_Net]: C307.2 R322.2
N$45 [MV_Net]: C308.2 R323.2
N$46: C318.1 R346.2 R347.1
N$47: C437.2 C438.2 TR305.1
N$48 [Weld-]: D310.1 D310.3 D311.1 D311.3 D312.1 D312.3 R441.1 TR305.3
N$49 [Weld-]: D307.1 D307.3 D308.1 D308.3 D309.1 D309.3 R440.2 TR305.5
N$51 [LV_Net]: R439.2 R440.1
N$52 [LV_Net]: C419.1 R439.1
N$53 [LV_Net]: C420.1 R442.2
N$55 [LV_Net]: R441.2 R442.1
N$56 [HV_Net-]: D314.A R401.1 R427.1
N$57: C317.1 IC302.3(IN+) R346.1 R350.2
N$58 [MV_Net]: IC309.2(FB) R402.2 R403.2
N$59 [MV_Net]: C423.2 R397.2 R404.2 R425.1
N$60 [MV_Net]: IC312.1(ADJ) R430.1 R432.1
N$61 [MV_Net]: C359.1 IC309.4(REF) R403.1
N$62 [MV_Net]: IC313.1(ADJ) R431.1 R433.1
N$63 [MV_Net]: D318.1(C) IC309.8(LX) L307.2
N$64 [MV_Net]: D316.1(C) IC308.8(LX) L303.2
N$65 [MV_Net]: C354.1 IC308.4(REF) R400.1
N$66 [MV_Net]: IC308.2(FB) R399.2 R400.2
N$68 [MV_Net]: D300.A R404.1
N$69 [HV_Net-]: C424.2 R406.2 R410.2 R426.1
N$70 [HV_Net-]: C387.1 D313.A R372.1 R424.1
N$71: C425.2 R412.1 R416.2 R428.2
N$72: D304.A R416.1
N$73 [HV_Net-]: D301.A R410.1
N$74: C312.1 R333.2
N$75: R306.1 R307.2 R314.1
N$76: R461.2 T313.3(D)
N$77: C311.2 C312.2 D306.1(C) IC302.1(OUT) R336.1
N$78: C305.1 R314.2
N$79: R320.2 R324.2 T302.1(G)
N$80: R318.2 R319.1 T302.3(D)
N$81: C310.1 R317.2 R318.1
N$82: C309.1 IC300.3(IN+) R317.1 R321.2
N$83 [HV_Net-]: C426.2 R418.2 R422.2 R429.1
N$84 [HV_Net-]: D305.A R422.1
N$85: C301.1 C305.2 IC300.4(IN-) R300.1 R306.2
N$86: C302.1 R300.2
N$87: C301.2 C302.2 D302.1(C) IC300.1(OUT) R305.1
N$88: C416.1 R307.1 R434.2
N$89: C417.1 R434.1 R435.1 R437.1
N$90: R435.2 R436.2 R438.2
N$92: D323.K(C) R436.1
N$94: C415.2 C418.1
N$103 [HV_Net-]: IC311.1(AIN)
N$105 [MV_Net]: IC306.1(AIN)
N$118 [HV_Net-]: IC307.1(AIN)
NDO_G_DRV_RST [LV_Net]: C372.2 C375.2 C378.2 C381.2 IC306.14(/RST_-_EN) IC307.14(/RST_-_EN) IC310.14(/RST_-_EN) IC311.14(/RST_-_EN) R390.2 R409.2 R415.2 R421.2 ; also sheet 4
NODE-A [HV_Net+]: C303.1 C304.1 D300.K(C) D304.K(C) R326.2 T300.2(D) T301.2(D) U301.1
NODE_A [MV_Net]: C300.1 C307.1 C330.2 C331.2 C339.1 C340.1 C342.1 C354.2 C358.2 C388.1 C389.1 C390.1 C391.1 C409.1 C411.1 C413.2 C423.1 C427.2 C430.1 C431.1 C432.1 C437.1 C438.1 D301.K(C) D315.A IC306.3(COM) IC308.3(SHDN) IC308.5(GND) L303.1 R309.1 R310.1 R326.1 R398.2 R405.2 R432.2 T301.3(S) T304.2(D)
NODE_C [MV_Net]: C308.1 C351.1 C355.1 C356.1 C357.2 C359.2 C362.1 C384.1 C385.1 C386.2 C395.1 C396.1 C397.1 C398.1 C399.1 C410.1 C412.1 C414.2 C425.1 C428.2 C429.2 C434.1 C435.1 C436.1 D305.K(C) D319.A IC309.3(SHDN) IC309.5(GND) IC310.3(COM) L307.1 R311.1 R312.1 R417.2 R433.2 T300.3(S) T303.2(D) TR305.6
PSFB_EN: Q300.1(G) R388.1 R391.2 ; also sheet 4
QA_GATE [MV_Net]: C300.2 IC306.7(CLAMPI) R309.2 R325.1 R327.1 T301.1(G)
QA_OC [MV_Net]: C342.2 D315.C IC306.2(OC) R405.1 R425.2
QB_GATE [HV_Net-]: C353.2 IC307.7(CLAMPI) R304.1 R313.1 R328.2 T304.1(G)
QB_OC [HV_Net-]: C345.2 D317.C IC307.2(OC) R411.1 R426.2
QC_GATE [MV_Net]: C351.2 IC310.7(CLAMPI) R312.2 R332.1 R385.1 T300.1(G)
QC_OC: C362.2 D319.C IC310.2(OC) R412.2 R417.1
QD_GATE [HV_Net-]: C352.2 IC311.7(CLAMPI) R331.2 R387.1 R396.1 T303.1(G)
QD_OC [HV_Net-]: C365.2 D320.C IC311.2(OC) R423.1 R429.2
SS-EN [LV_Net]: C324.2 IC1.5(SS/EN) Q300.3(D) R389.2
V_3V3 [LV_Net]: C323.2 C325.1 C328.2 C329.2 C334.2 C347.1 D324.2(C2) IC301.5(VCC) L302.1 L304.1 L308.1 L309.1 T307.3(D) T308.3(D) T309.3(D) T310.3(D) ; also sheet 2,4,5
V_5V0 [LV_Net]: C346.1 C348.1 IC300.5(VCC) IC302.5(VCC) R319.2 R343.2 R348.2 ; also sheet 2,5
V_12V0 [LV_Net]: C337.1 C338.2 L300.2 R388.2 ; also sheet 1,2
V_12V0_AUX [HV_Net-]: C335.2 C336.2 C366.2 C367.2 C382.2 C393.1(+) C394.2 IC307.5(VDD) IC311.5(VDD) R372.2 R401.2 R406.1 R418.1 R424.2 R427.2 ; also sheet 2
V_-5V0_AUX [HV_Net-]: C349.2 C350.2 C368.2 C369.2 C392.2 C408.2 IC307.8(VEE) IC311.8(VEE) ; also sheet 2
V_CS_F [LV_Net]: C306.2 D324.3(C1_A2) IC1.15(CS) R315.2 R363.1 R366.1
V_RECT_F_MINUS [HV_Net-]: C335.1 C336.1 C345.1 C349.1 C350.1 C352.1 C353.1 C365.1 C366.1 C367.1 C368.1 C369.1 C382.1 C387.2 C392.1 C393.2(-) C394.1 C408.1 C424.1 C426.1 D317.A D320.A IC307.3(COM) IC311.3(COM) R328.1 R329.1 R330.1 R331.1 R398.1 R411.2 R423.2 T303.3(S) T304.3(S) ; also sheet 1,2
V_RECT_F_PLUS [HV_Net+]: U300.1 ; also sheet 1
VDD_A [MV_Net]: C330.1 C331.1 C358.1 C411.2 C427.1 D313.K(C) D321.C IC312.3(IN)
VDD_C [MV_Net]: C357.1 C386.1 C412.2 C428.1 C429.1 D314.K(C) D322.C IC313.3(IN)
VDDA_REG [MV_Net]: C388.2 C389.2 C409.2 C413.1 C430.2 C431.2 C432.2 D321.A IC306.5(VDD) IC308.6(V+/1) IC308.7(V+/2) IC312.2(OUT) IC312.4(TAB) R397.1 R430.2
VDDC_REG [MV_Net]: C384.2 C385.2 C395.2 C410.2 C414.1 C434.2 C435.2 C436.2 D322.A IC309.6(V+/1) IC309.7(V+/2) IC310.5(VDD) IC313.2(OUT) IC313.4(TAB) R428.1 R431.2
VEE_A [MV_Net]: C339.2 C340.2 C390.2 C391.2 D316.2(A) IC306.8(VEE) IC308.1(OUT) R399.1
VEE_C [MV_Net]: C355.2 C356.2 C396.2 C397.2 C398.2 C399.2 D318.2(A) IC309.1(OUT) IC310.8(VEE) R402.1
VREF: C319.1 IC1.1(VREF) R352.1 R368.2 R369.2 R374.1
WELDER+ [Weld+]: C415.1 C419.2 C420.2 D307.2 D308.2 D309.2 D310.2 D311.2 D312.2 D323.A V300.2 X2.1 X2.1-1 X2.1-2 X2.1-3 X2.1-4 X2.1-5 X2.1-6 X2.1-7 X2.1-8 X2.1-9 X2.1-10 X2.1-11 X2.1-12 X2.1-13 X2.1-14 X2.1-15 X2.1-16 X2.1-17 X2.1-18 X2.1-19 X2.1-20 X2.1-21 X2.1-22 X2.1-23 X2.1-24 X2.1-25 X2.1-26 X2.1-27 X2.1-28 X2.1-29 X2.1-30 X2.1-31 X2.1-32 X2.1-33 X2.1-34 X2.1-35
WELDER- [Weld-]: R335.1 R340.2 V300.1 X4.1 X4.1-1 X4.1-2 X4.1-3 X4.1-4 X4.1-5 X4.1-6 X4.1-7 X4.1-8 X4.1-9 X4.1-10 X4.1-11 X4.1-12 X4.1-13 X4.1-14 X4.1-15 X4.1-16 X4.1-17 X4.1-18 X4.1-19 X4.1-20 X4.1-21 X4.1-22 X4.1-23 X4.1-24 X4.1-25 X4.1-26 X4.1-27 X4.1-28 X4.1-29 X4.1-30 X4.1-31 X4.1-32 X4.1-33 X4.1-34 X4.1-35
Unconnected: IC1.17(OUTF) IC1.18(OUTE) IC306.16(APWM) IC307.16(APWM) IC310.1(AIN) IC310.16(APWM) IC311.16(APWM)

## Sheet 4 of 5
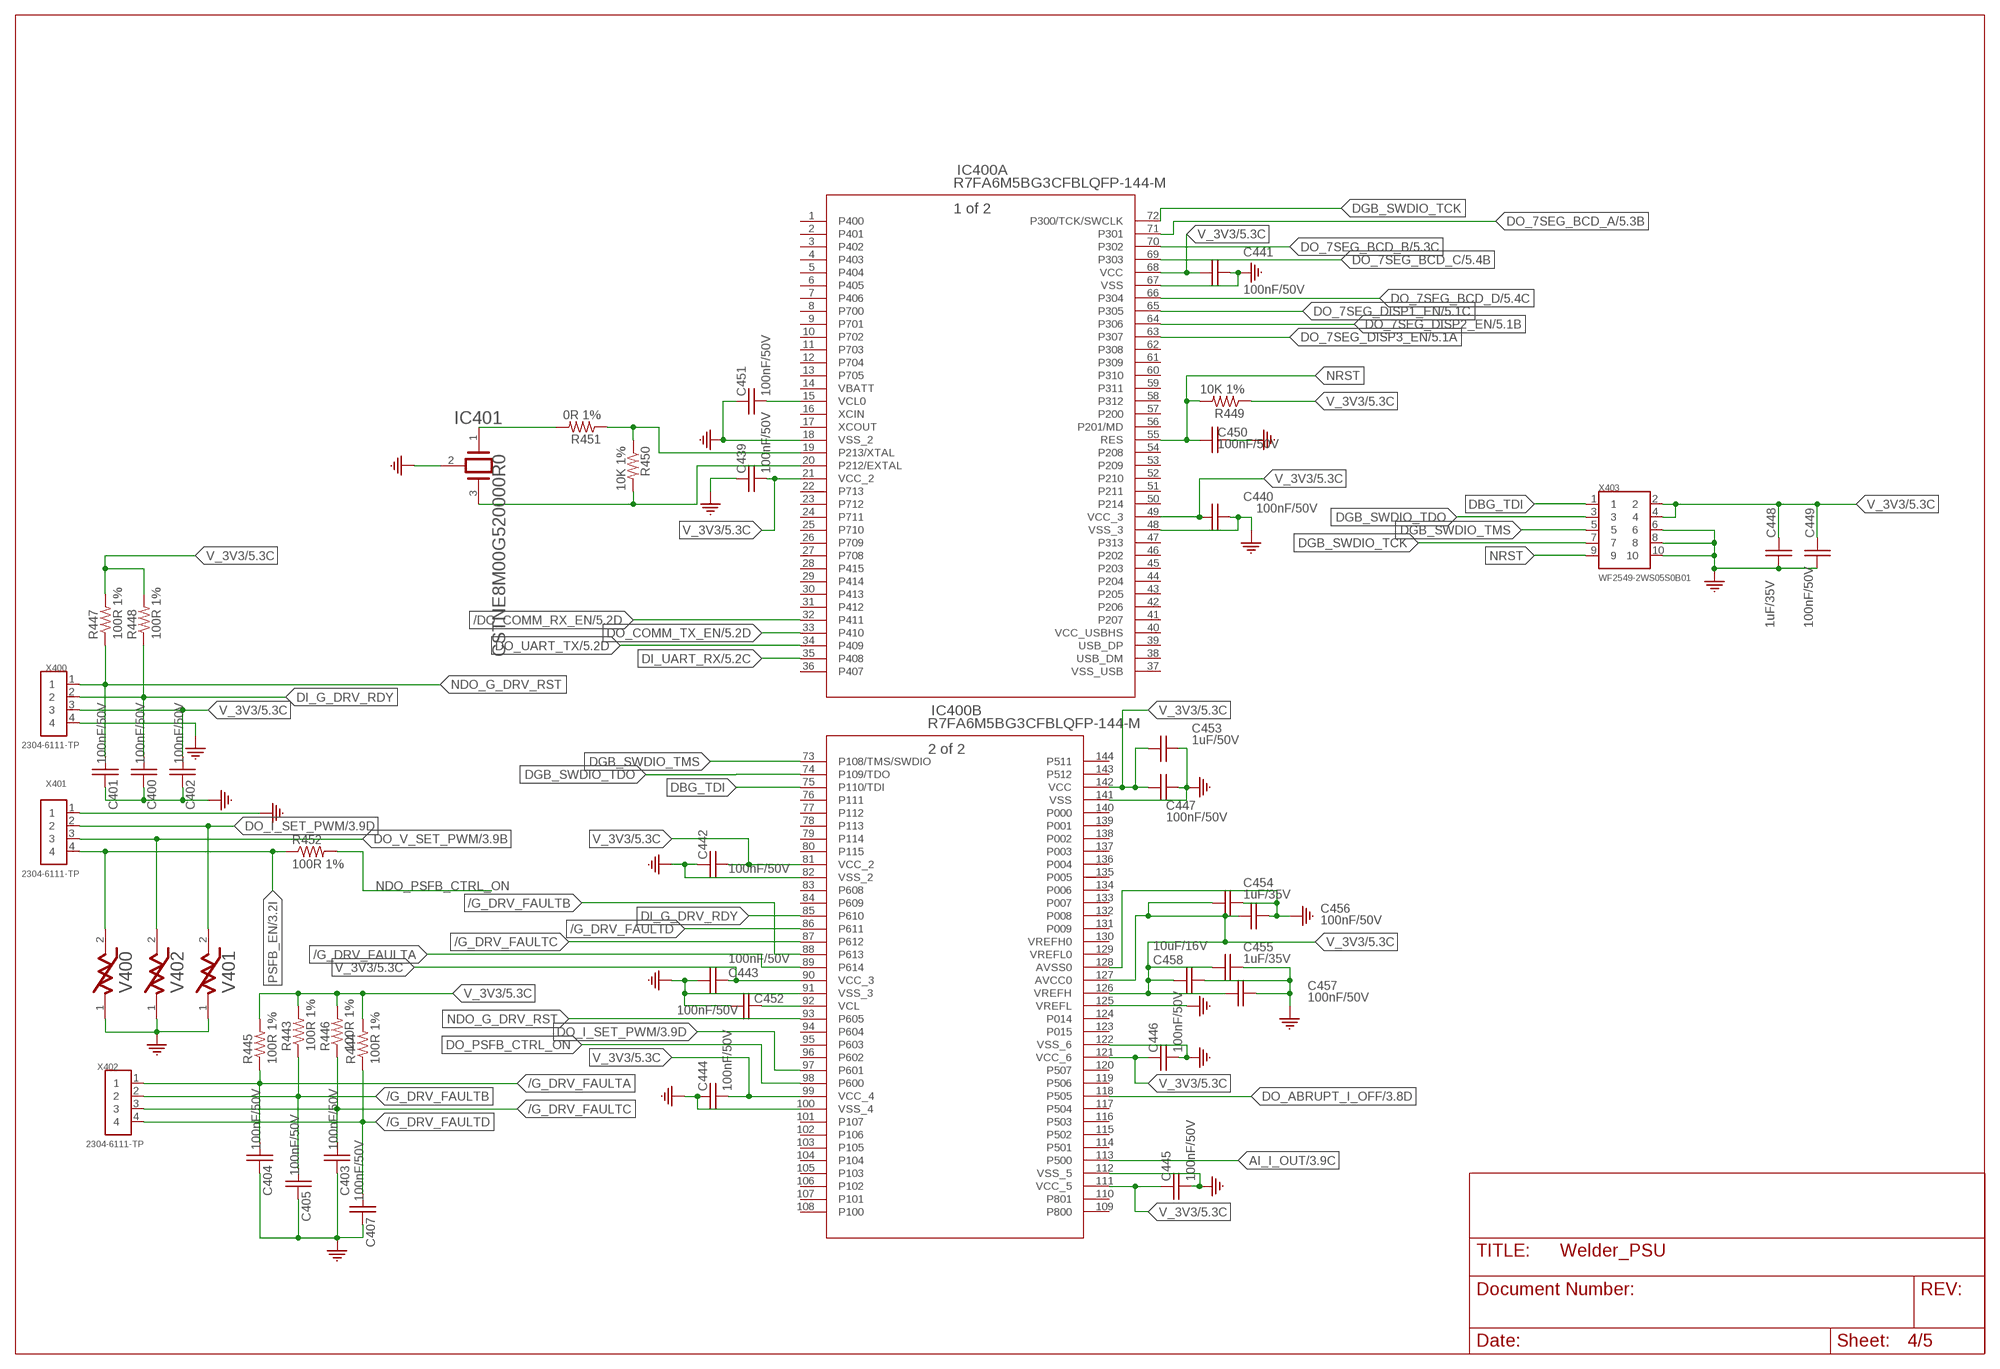
[diagram p4: schematic, sheet 4]

### Parts
C400  100nF/50V  C_0603EIA0603  [EIA0603]
C401  100nF/50V  C_0603EIA0603  [EIA0603]
C402  100nF/50V  C_0603EIA0603  [EIA0603]
C403  100nF/50V  C_0603EIA0603  [EIA0603]
C404  100nF/50V  C_0603EIA0603  [EIA0603]
C405  100nF/50V  C_0603EIA0603  [EIA0603]
C407  100nF/50V  C_0603EIA0603  [EIA0603]
C439  100nF/50V  C_0603EIA0603  [EIA0603]
C440  100nF/50V  C_0603EIA0603  [EIA0603]
C441  100nF/50V  C_0603EIA0603  [EIA0603]
C442  100nF/50V  C_0603EIA0603  [EIA0603]
C443  100nF/50V  C_0603EIA0603  [EIA0603]
C444  100nF/50V  C_0603EIA0603  [EIA0603]
C445  100nF/50V  C_0603EIA0603  [EIA0603]
C446  100nF/50V  C_0603EIA0603  [EIA0603]
C447  100nF/50V  C_0603EIA0603  [EIA0603]
C448  1uF/35V  C_0603EIA0603  [EIA0603]
C449  100nF/50V  C_0603EIA0603  [EIA0603]
C450  100nF/50V  C_0603EIA0603  [EIA0603]
C451  100nF/50V  C_0603EIA0603  [EIA0603]
C452  100nF/50V  C_0603EIA0603  [EIA0603]
C453  1uF/50V  C_0603EIA0603  [EIA0603]
C454  1uF/35V  C_0603EIA0603  [EIA0603]
C455  1uF/35V  C_0603EIA0603  [EIA0603]
C456  100nF/50V  C_0603EIA0603  [EIA0603]
C457  100nF/50V  C_0603EIA0603  [EIA0603]
C458  10uF/16V  C_0603EIA0603  [EIA0603]
IC400  R7FA6M5BG3CFBLQFP-144-M  [LQFP-144-M]
IC401  CSTNE8M00G520000R0  [CSTNE8M00G520000R0]
R443  100R 1%  R_0603  [EIA0603]
R444  100R 1%  R_0603  [EIA0603]
R445  100R 1%  R_0603  [EIA0603]
R446  100R 1%  R_0603  [EIA0603]
R447  100R 1%  R_0603  [EIA0603]
R448  100R 1%  R_0603  [EIA0603]
R449  10K 1%  R_0603  [EIA0603]
R450  10K 1%  R_0603  [EIA0603]
R451  0R 1%  R_0603  [EIA0603]
R452  100R 1%  R_0603  [EIA0603]
V400  0603ESDA-24NSMD  [EIA0603]
V401  0603ESDA-24NSMD  [EIA0603]
V402  0603ESDA-24NSMD  [EIA0603]
X400  2304-6111-TP  [X04_100MIL]
X401  2304-6111-TP  [X04_100MIL]
X402  2304-6111-TP  [X04_100MIL]
X403  WF2549-2WS05S0B01  [X10_100MIL_2XROW_VERT]

### Nets
/DO_COMM_RX_EN [LV_Net]: IC400.32(A:P411) ; also sheet 5
/G_DRV_FAULTA: C404.2 IC400.89(B:P614) R445.1 X402.1 ; also sheet 3
/G_DRV_FAULTB: C405.2 IC400.88(B:P613) R443.1 X402.2 ; also sheet 3
/G_DRV_FAULTC: C403.2 IC400.87(B:P612) R446.1 X402.3 ; also sheet 3
/G_DRV_FAULTD: C407.2 IC400.86(B:P611) R444.1 X402.4 ; also sheet 3
AI_I_OUT: IC400.113(B:P500) ; also sheet 3
DBG_TDI [LV_Net]: IC400.75(B:P110/TDI) X403.1
DGB_SWDIO_TCK [LV_Net]: IC400.72(A:P300/TCK/SWCLK) X403.7
DGB_SWDIO_TDO [LV_Net]: IC400.74(B:P109/TDO) X403.3
DGB_SWDIO_TMS [LV_Net]: IC400.73(B:P108/TMS/SWDIO) X403.5
DI_G_DRV_RDY [LV_Net]: C400.2 IC400.85(B:P610) R448.1 X400.2 ; also sheet 3
DI_UART_RX [LV_Net]: IC400.35(A:P408) ; also sheet 5
DO_7SEG_BCD_A [LV_Net]: IC400.71(A:P301) ; also sheet 5
DO_7SEG_BCD_B [LV_Net]: IC400.70(A:P302) ; also sheet 5
DO_7SEG_BCD_C [LV_Net]: IC400.69(A:P303) ; also sheet 5
DO_7SEG_BCD_D [LV_Net]: IC400.66(A:P304) ; also sheet 5
DO_7SEG_DISP1_EN [LV_Net]: IC400.65(A:P305) ; also sheet 5
DO_7SEG_DISP2_EN [LV_Net]: IC400.64(A:P306) ; also sheet 5
DO_7SEG_DISP3_EN [LV_Net]: IC400.63(A:P307) ; also sheet 5
DO_ABRUPT_I_OFF: IC400.118(B:P505) ; also sheet 3
DO_COMM_TX_EN [LV_Net]: IC400.33(A:P410) ; also sheet 5
DO_I_SET_PWM: IC400.97(B:P601) V401.2 X401.2 ; also sheet 3
DO_PSFB_CTRL_ON: IC400.98(B:P600)
DO_UART_TX [LV_Net]: IC400.34(A:P409) ; also sheet 5
DO_V_SET_PWM: V402.2 X401.3 ; also sheet 3
GND [LV_Net]: C400.1 C401.1 C402.1 C403.1 C404.1 C405.1 C407.1 C439.1 C440.2 C441.2 C442.1 C443.1 C444.1 C445.2 C446.2 C447.2 C448.1 C449.1 C450.2 C451.1 C452.2 C453.2 C454.2 C455.2 C456.2 C457.2 C458.2 IC400.18(A:VSS_2) IC400.48(A:VSS_3) IC400.67(A:VSS) IC400.82(B:VSS_2) IC400.91(B:VSS_3) IC400.100(B:VSS_4) IC400.112(B:VSS_5) IC400.122(B:VSS_6) IC400.125(B:VREFL) IC400.128(B:AVSS0) IC400.141(B:VSS) IC401.2(GND) V400.1 V401.1 V402.1 X400.4 X401.1 X403.6 X403.8 X403.10 ; also sheet 1,2,3,5
N$111: C451.2 IC400.15(A:VCL0)
N$113: C452.1 IC400.92(B:VCL)
N$114: IC400.20(A:P212/EXTAL) IC401.3(OUTPUT) R450.2
N$115: IC401.1(INPUT) R451.2
N$116: IC400.19(A:P213/XTAL) R450.1 R451.1
NDO_G_DRV_RST [LV_Net]: C401.2 IC400.93(B:P605) R447.1 X400.1 ; also sheet 3
NDO_PSFB_CTRL_ON: R452.2
NRST: C450.1 IC400.55(A:RES) R449.2 X403.9
PSFB_EN: R452.1 V400.2 X401.4 ; also sheet 3
V_3V3 [LV_Net]: C402.2 C439.2 C440.1 C441.1 C442.2 C443.2 C444.2 C445.1 C446.1 C447.1 C448.2 C449.2 C453.1 C454.1 C455.1 C456.1 C457.1 C458.1 IC400.21(A:VCC_2) IC400.49(A:VCC_3) IC400.68(A:VCC) IC400.81(B:VCC_2) IC400.90(B:VCC_3) IC400.99(B:VCC_4) IC400.111(B:VCC_5) IC400.121(B:VCC_6) IC400.126(B:VREFH) IC400.127(B:AVCC0) IC400.142(B:VCC) R443.2 R444.2 R445.2 R446.2 R447.2 R448.2 R449.1 X400.3 X403.2 X403.4 ; also sheet 2,3,5
Unconnected: IC400.1(A:P400) IC400.2(A:P401) IC400.3(A:P402) IC400.4(A:P403) IC400.5(A:P404) IC400.6(A:P405) IC400.7(A:P406) IC400.8(A:P700) IC400.9(A:P701) IC400.10(A:P702) IC400.11(A:P703) IC400.12(A:P704) IC400.13(A:P705) IC400.16(A:XCIN) IC400.17(A:XCOUT) IC400.22(A:P713) IC400.23(A:P712) IC400.24(A:P711) IC400.25(A:P710) IC400.26(A:P709) IC400.27(A:P708) IC400.28(A:P415) IC400.29(A:P414) IC400.30(A:P413) IC400.31(A:P412) IC400.36(A:P407) IC400.38(A:USB_DM) IC400.39(A:USB_DP) IC400.41(A:P207) IC400.42(A:P206) IC400.43(A:P205) IC400.44(A:P204) IC400.45(A:P203) IC400.46(A:P202) IC400.47(A:P313) IC400.50(A:P214) IC400.51(A:P211) IC400.52(A:P210) IC400.53(A:P209) IC400.54(A:P208) IC400.56(A:P201/MD) IC400.57(A:P200) IC400.58(A:P312) IC400.59(A:P311) IC400.60(A:P310) IC400.61(A:P309) IC400.62(A:P308) IC400.76(B:P111) IC400.77(B:P112) IC400.78(B:P113) IC400.79(B:P114) IC400.80(B:P115) IC400.83(B:P608) IC400.84(B:P609) IC400.94(B:P604) IC400.95(B:P603) IC400.96(B:P602) IC400.101(B:P107) IC400.102(B:P106) IC400.103(B:P105) IC400.104(B:P104) IC400.105(B:P103) IC400.106(B:P102) IC400.107(B:P101) IC400.108(B:P100) IC400.109(B:P800) IC400.110(B:P801) IC400.114(B:P501) IC400.115(B:P502) IC400.116(B:P503) IC400.117(B:P504) IC400.119(B:P506) IC400.120(B:P507) IC400.123(B:P015) IC400.124(B:P014) IC400.131(B:P009) IC400.132(B:P008) IC400.133(B:P007) IC400.134(B:P006) IC400.135(B:P005) IC400.136(B:P004) IC400.137(B:P003) IC400.138(B:P002) IC400.139(B:P001) IC400.140(B:P000) IC400.143(B:P512) IC400.144(B:P511)

## Sheet 5 of 5
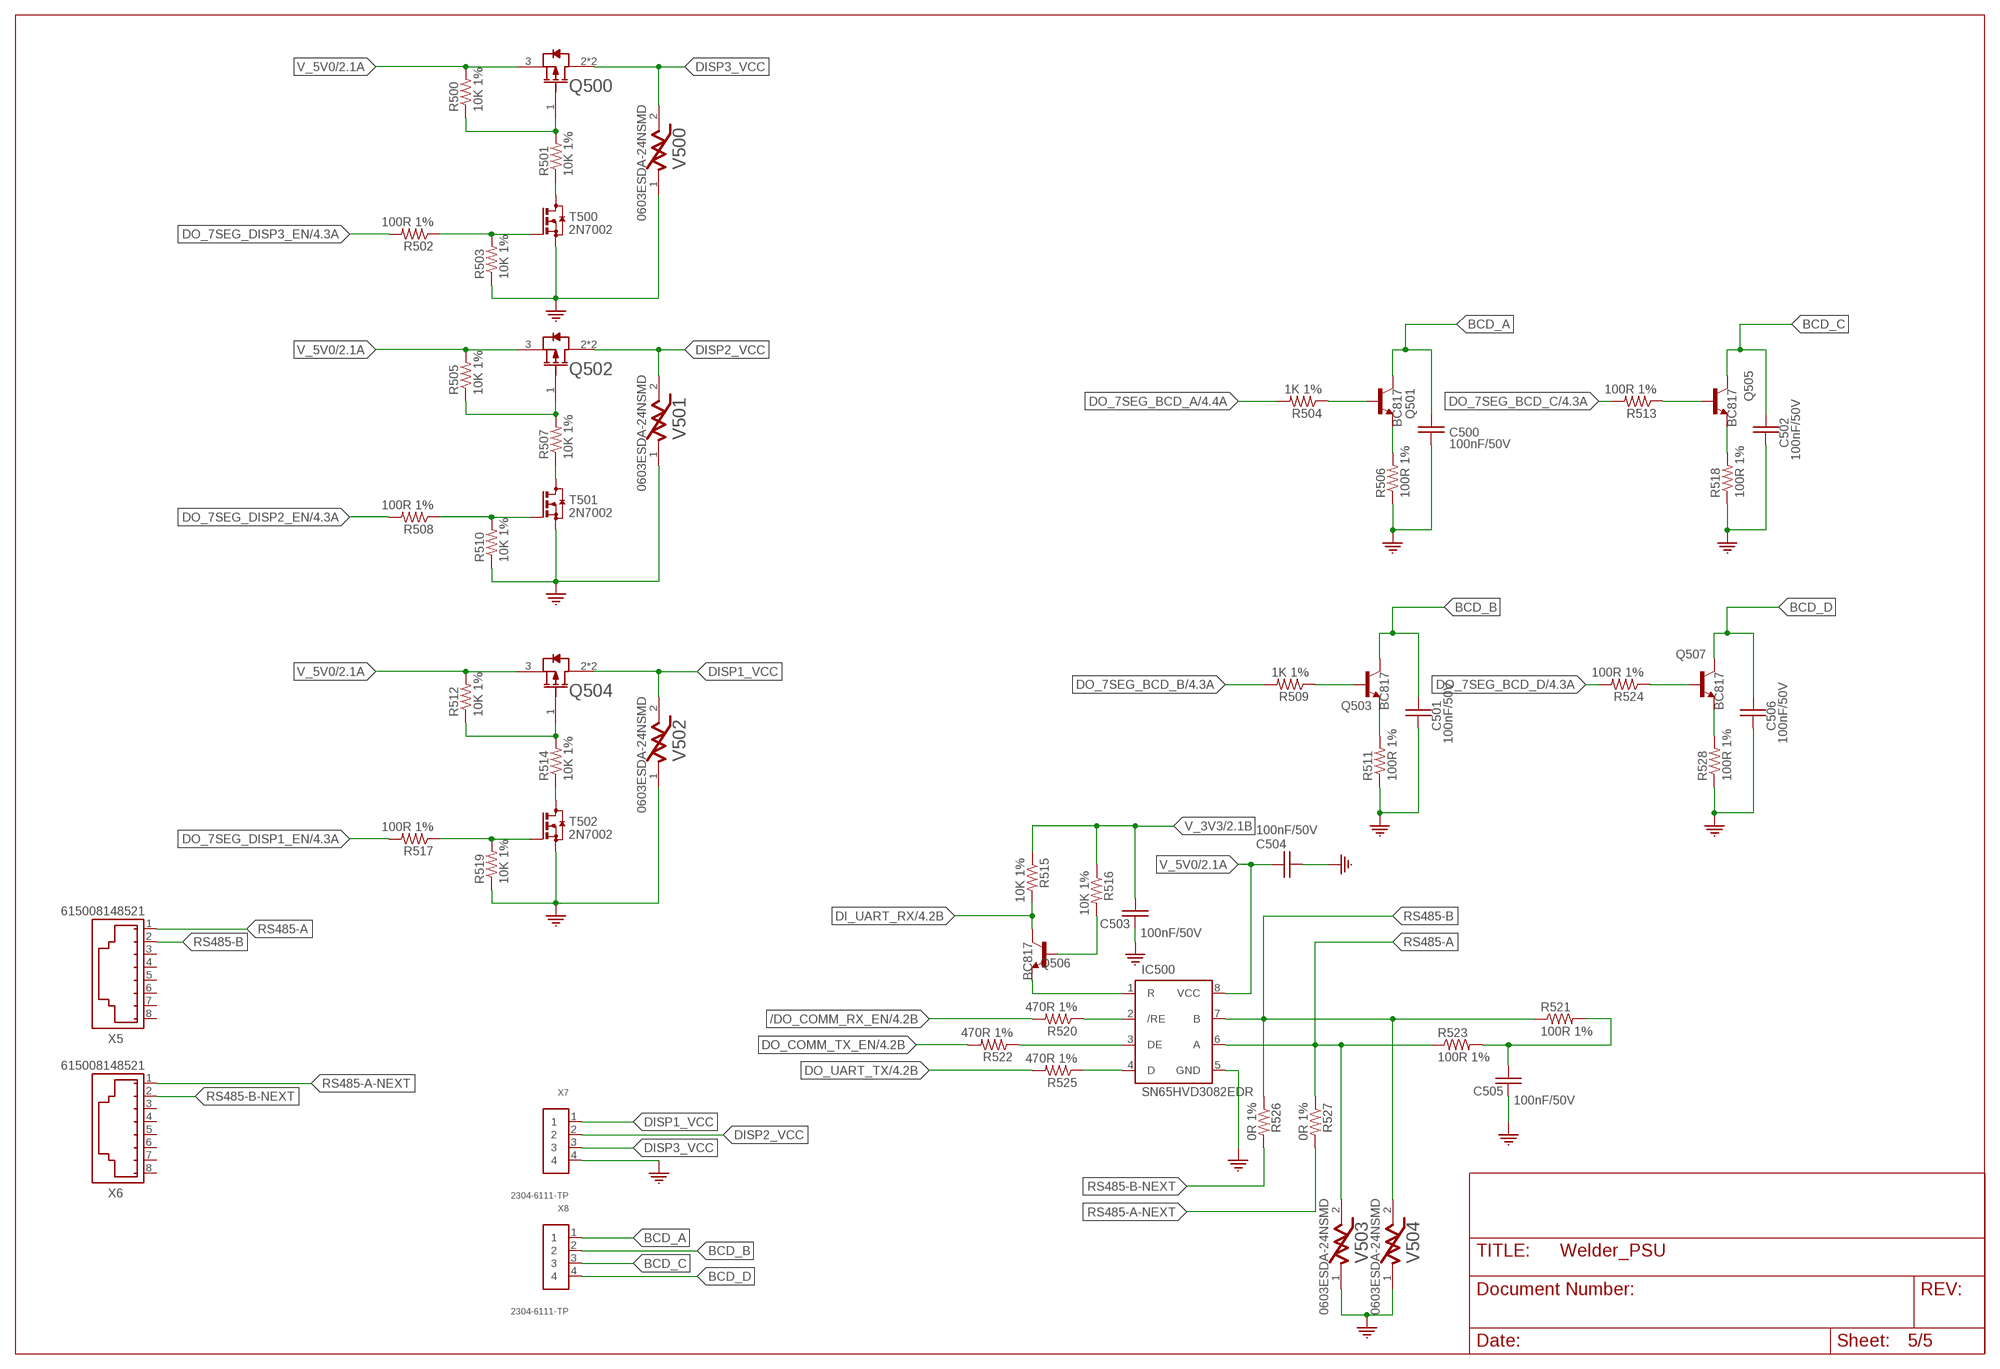
[diagram p5: schematic, sheet 5]

### Parts
C500  100nF/50V  C_0603EIA0603  [EIA0603]
C501  100nF/50V  C_0603EIA0603  [EIA0603]
C502  100nF/50V  C_0603EIA0603  [EIA0603]
C503  100nF/50V  C_0603EIA0603  [EIA0603]
C504  100nF/50V  C_0603EIA0603  [EIA0603]
C505  100nF/50V  C_0603EIA0603  [EIA0603]
C506  100nF/50V  C_0603EIA0603  [EIA0603]
IC500  SN65HVD3082EDR  [SOIC8]
Q500  DMP6185SEQ-13  [SOT223]
Q501  BC817  [SOT23]
Q502  DMP6185SEQ-13  [SOT223]
Q503  BC817  [SOT23]
Q504  DMP6185SEQ-13  [SOT223]
Q505  BC817  [SOT23]
Q506  BC817  [SOT23]
Q507  BC817  [SOT23]
R500  10K 1%  R_0603  [EIA0603]
R501  10K 1%  R_0603  [EIA0603]
R502  100R 1%  R_0603  [EIA0603]
R503  10K 1%  R_0603  [EIA0603]
R504  1K 1%  R_0603  [EIA0603]
R505  10K 1%  R_0603  [EIA0603]
R506  100R 1%  R_0603  [EIA0603]
R507  10K 1%  R_0603  [EIA0603]
R508  100R 1%  R_0603  [EIA0603]
R509  1K 1%  R_0603  [EIA0603]
R510  10K 1%  R_0603  [EIA0603]
R511  100R 1%  R_0603  [EIA0603]
R512  10K 1%  R_0603  [EIA0603]
R513  100R 1%  R_0603  [EIA0603]
R514  10K 1%  R_0603  [EIA0603]
R515  10K 1%  R_0603  [EIA0603]
R516  10K 1%  R_0603  [EIA0603]
R517  100R 1%  R_0603  [EIA0603]
R518  100R 1%  R_0603  [EIA0603]
R519  10K 1%  R_0603  [EIA0603]
R520  470R 1%  R_0603  [EIA0603]
R521  100R 1%  R_0603  [EIA0603]
R522  470R 1%  R_0603  [EIA0603]
R523  100R 1%  R_0603  [EIA0603]
R524  100R 1%  R_0603  [EIA0603]
R525  470R 1%  R_0603  [EIA0603]
R526  0R 1%  R_0603  [EIA0603]
R527  0R 1%  R_0603  [EIA0603]
R528  100R 1%  R_0603  [EIA0603]
T500  2N7002  [SOT23]
T501  2N7002  [SOT23]
T502  2N7002  [SOT23]
V500  0603ESDA-24NSMD  [EIA0603]
V501  0603ESDA-24NSMD  [EIA0603]
V502  0603ESDA-24NSMD  [EIA0603]
V503  0603ESDA-24NSMD  [EIA0603]
V504  0603ESDA-24NSMD  [EIA0603]
X5  615008148521  [615008148521]
X6  615008148521  [615008148521]
X7  2304-6111-TP  [X04_100MIL]
X8  2304-6111-TP  [X04_100MIL]

### Nets
/DO_COMM_RX_EN [LV_Net]: R520.2 ; also sheet 4
BCD_A: C500.1 Q501.3(C) X8.1
BCD_B: C501.1 Q503.3(C) X8.2
BCD_C [LV_Net]: C502.1 Q505.3(C) X8.3
BCD_D [LV_Net]: C506.1 Q507.3(C) X8.4
DI_UART_RX [LV_Net]: Q506.3(C) R515.2 ; also sheet 4
DISP1_VCC [LV_Net]: Q504.2(DRAIN) Q504.4(DRAIN) V502.2 X7.1
DISP2_VCC [LV_Net]: Q502.2(DRAIN) Q502.4(DRAIN) V501.2 X7.2
DISP3_VCC [LV_Net]: Q500.2(DRAIN) Q500.4(DRAIN) V500.2 X7.3
DO_7SEG_BCD_A [LV_Net]: R504.2 ; also sheet 4
DO_7SEG_BCD_B [LV_Net]: R509.2 ; also sheet 4
DO_7SEG_BCD_C [LV_Net]: R513.2 ; also sheet 4
DO_7SEG_BCD_D [LV_Net]: R524.2 ; also sheet 4
DO_7SEG_DISP1_EN [LV_Net]: R517.2 ; also sheet 4
DO_7SEG_DISP2_EN [LV_Net]: R508.2 ; also sheet 4
DO_7SEG_DISP3_EN [LV_Net]: R502.2 ; also sheet 4
DO_COMM_TX_EN [LV_Net]: R522.2 ; also sheet 4
DO_UART_TX [LV_Net]: R525.2 ; also sheet 4
GND [LV_Net]: C500.2 C501.2 C502.2 C503.1 C504.1 C505.1 C506.2 IC500.5(GND) R503.1 R506.1 R510.1 R511.1 R518.1 R519.1 R528.1 T500.2(S) T501.2(S) T502.2(S) V500.1 V501.1 V502.1 V503.1 V504.1 X7.4 ; also sheet 1,2,3,4
N$117: C505.2 R521.2 R523.2
N$119: IC500.1(R) Q506.2(E)
N$120: Q506.1(B) R516.2
N$121: Q501.1(B) R504.1
N$123: IC500.2(/RE) R520.1
N$124: Q501.2(E) R506.2
N$127: IC500.3(DE) R522.1
N$128: IC500.4(D) R525.1
N$129: Q503.1(B) R509.1
N$131: Q503.2(E) R511.2
N$133: Q505.1(B) R513.1
N$135: Q505.2(E) R518.2
N$137: Q507.1(B) R524.1
N$139: Q507.2(E) R528.2
N$140: R508.1 R510.2 T501.1(G)
N$141: R502.1 R503.2 T500.1(G)
N$142: R501.1 T500.3(D)
N$143: Q500.1(GATE) R500.1 R501.2
N$145: R507.1 T501.3(D)
N$147: Q502.1(GATE) R505.1 R507.2
N$150: R517.1 R519.2 T502.1(G)
N$151: R514.1 T502.3(D)
N$152: Q504.1(GATE) R512.1 R514.2
RS485-A [LV_Net]: IC500.6(A) R523.1 R527.1 V503.2 X5.1
RS485-A-NEXT: R527.2 X6.1
RS485-B [LV_Net]: IC500.7(B) R521.1 R526.1 V504.2 X5.2
RS485-B-NEXT: R526.2 X6.2
V_3V3 [LV_Net]: C503.2 R515.1 R516.1 ; also sheet 2,3,4
V_5V0 [LV_Net]: C504.2 IC500.8(VCC) Q500.3(SOURCE) Q502.3(SOURCE) Q504.3(SOURCE) R500.2 R505.2 R512.2 ; also sheet 2,3
Unconnected: X5.3 X5.4 X5.5 X5.6 X5.7 X5.8 X6.3 X6.4 X6.5 X6.6 X6.7 X6.8

## Power pins joined to a net without a drawn wire
VBATT: IC400.14(A:VBATT)
VCC_USBHS: IC400.40(A:VCC_USBHS)
VREFH0: IC400.130(B:VREFH0)
VREFL0: IC400.129(B:VREFL0)
VSS_USB: IC400.37(A:VSS_USB)

## Library data of the parts
C100 C101 C103-C106 = Labops_Lib_AH:SLP152M250H9P3; DESCRIPTION: 1500µF, 250V, Radial, 3000HRS; MFN: SLP152M250H9P3; MFR: Cornell; PART_VALUE: 1500uF/250V
C102 = Labops_Lib_AH:R49AN347050B1M: 0.47µF X Cap 330V 800V Polypropylene (PP), Metallized Radial; DESCRIPTION: Film,X1,470nF/330Vac,THT; LIB_STATUS: Verified; MFN: R49AN347050B1M; MFR: Kemet; OUR_STOCK: 8; PART_VALUE: 470nF/330VAC; PRICE-1: 1.51; SUPPLIER-1: Digikey
C108 = Labops_Lib_AH:ERP610W471MEF0; DESCRIPTION: 470pF ±20% 760V Ceramic Capacitor Radial, Y5U, X1,Y1; MFN: ERP610W471MEF0; MFR: Vishay; PART_VALUE: 470pF/760V
C200 C203 C204 C206 C210 C300-C302 C305 C306 C309-C320 C323-C325 C328-C340 C342-C392 C394-C405 C407-C418 C421-C436 C439-C458 C500-C506 = Labops_Lib_AH:C_0603
C201 C202 C205 C207 C211 C393 = Labops_Lib_AH:50PX470MEFC10X20: Electrolytic Cap, 470µF, 25V, Low ESR, Kemet, Pitch=5mm, Dia=10mm, L=12,5mm; DESCRIPTION: 470uF ±20% 50V 10mm 20mm 5mm 2000Hrs @ 105℃ -55℃ ~ +105℃; LIB_STATUS: Prototype; MFN: 50PX470MEFC10X20; MFR: Rubicon; OUR_STOCK: 20; PART_VALUE: 470uF/50V; PRICE-1: 0.14; SUPPLIER-1: LCSC; TECHNOLOGY: THT
C303 C304 C307 C308 = Labops_Lib_AH:HVCC153Y6P471MEAX; DESCRIPTION: 470pF/15KV, 12.5mm pitch, THT; MFN: HVCC153Y6P471MEAX; MFR: Vishay; PART_VALUE: 470pF/15KV
C419 C420 = Labops_Lib_AH:CK45-B3FD102KYVNA; DESCRIPTION: 1nF/3KV, THT 7.5mm pitch, TDK; MFN: CK45-B3FD102KYVNA; MFR: TDK; PART_VALUE: 1nF/3KV
C437 C438 = Labops_Lib_AH:ECW-F4245JLB; DESCRIPTION: 2.4uF ±5% 400V Film Capacitor Radial,MPP; MFN: ECW-F4245JLB; MFR: Panasonic; PART_VALUE: 2.4uF/400V
D100 D103 = Labops_Lib_AH:RS1M-13-F; DESCRIPTION: Gen Purpose , 1KV,1A, 500ns, SMA; LIB_STATUS: Prototype; MFN: RS1M-13-F; MFR: Diodes; OUR_STOCK: 10; PART_VALUE: RS1M-13-F; PRICE-1: 0.07; SUPPLIER-1: LCSC
D101 = Labops_Lib_AH:GBPC3510W: BRIDGE RECT 1xPhase 1KV 35A GBPC-W Package; DESCRIPTION: Bridge 1x Phase 1KV 35A; MFN: GBPC3510W; PART_VALUE: GBPC3510W
D102 = Labops_Lib_AH:1N5387BRLG; DESCRIPTION: ±5% 190V 500nA @ 144V 5W Axial Zener Diodes; LIB_STATUS: Prototype; MFN: 1N5387BRLG; MFR: On Semi; OUR_STOCK: 20; PART_VALUE: 190V 5W; PRICE-1: 0.38; SUPPLIER-1: LCSC
D104 D105 = Labops_Lib_AH:1N4739A; DESCRIPTION: Zener, 9.1V, 5%,1.6Watt, Axial DO-41; MFN: 1N4739A; PART_VALUE: 1N4739A
D200 D201 = Labops_Lib_AH:26-21/GPC-F3138B/CA; DESCRIPTION: Green SMD LED 1206, 160mcd; LIB_STATUS: Prototype; MFN: 26-21/GPC-F3138B/CA; MFR: Everlight; OUR_STOCK: 50; PART_VALUE: Green LED; PRICE-1: 0.06; SUPPLIER-1: LCSC
D300 D301 D303-D305 D323 = Labops_Lib_AH:STTH1R04U; DESCRIPTION: 1A, 400V, SMB, Fast Recovery; MFN: STTH1R04U; PART_VALUE: STTH1R04U
D302 D306 D316 D318 = Labops_Lib_AH:SS14; DESCRIPTION: Diode Schottky 1A/40V (SMA); LIB_STATUS: Prototype; MFN: SS14-LTP; MFR: MCC; OUR_STOCK: 10; PART_VALUE: Schottky 1A/40V; PRICE-1: 0.05; SUPPLIER-1: LCSC
D307-D312 = Labops_Lib_AH:FEP30DP-E3/45; DESCRIPTION: Dual Diode, Fast Recovery, 15A,600V, Common Cathode, TO-247AD; MFN: FEP30JP-E3/45; PART_VALUE: Diode 2x15A
D313 D314 = Labops_Lib_AH:GB02SLT12-214; DESCRIPTION: Schottky SiC, 1.2KV, 2A SMB; MFN: GB02SLT12-214; MFR: GeneSic; PART_VALUE: 2A, 1.2KV
D315 D317 D319-D322 = Labops_Lib_AH:SD103AW; DESCRIPTION: Schottky 40V 350mA 600mV @ 200mA SOD-123; MFN: SD103AW; MFR: Onsemi, Guanddong Hottech; PART_VALUE: 350mA, 40V
D324 = Labops_Lib_AH:BAT54S; DESCRIPTION: 200mA, 30V, SOT23, Schottky; MFN: BAT54S; MFR: HT; PART_VALUE: 200mA,30V
IC1 = Labops_Lib_AH:UCC28951PWR: Phase Shift Full Bridge SMPS Controller, TI, TSSOP-24; DESCRIPTION: Phase Shift Full Bridge Controller, TSSOP24; MFN: UCC28951QPWRQ1; MFR: Texas Instruments; PART_VALUE: UCC28951
IC100 = Labops_Lib_AH:PC817; DESCRIPTION: Optocoupler, 1CH, DIP04, 5KV; LIB_STATUS: Prototype; MFN: PC817; MFR: Sharp, UTC; OUR_STOCK: 20; PART_VALUE: PC817; PRICE-1: 0.05; SUPPLIER-1: LCSC
IC300-IC302 = Labops_Lib_AH:LMV641: Opamp, 1MHz, SOT23-5, One Channel, Rail-Rail; DESCRIPTION: 1CH 10MHz 1 Low power 2.3 V/us 2.7V~12V SOT-23-5 OpAmp; MFN: LMV641MF/NOPB; MFR: Texas Instruments; PACKAGE: SOT23-5; PART_VALUE: LMV641
IC306 IC307 IC310 IC311 = Labops_Lib_AH:UCC21710; DESCRIPTION: Isolated Gate Driver SOIC16; MFN: UCC21710QDWQ1; PART_VALUE: UCC21710
IC308 IC309 = Labops_Lib_AH:MAX764CSA+; DESCRIPTION: Switching Regulator, Inverting, -5V/Adj SOIC8, Vin 3-16.5V; MFN: MAX764CSA+; MFR: Max IC; OUR_STOCK: 30; PART_VALUE: Buck/Boost IC; PRICE-1: 4.0; SUPPLIER-1: Mouser
IC312 IC313 = Labops_Lib_AH:LM317AEMP: Linear Voltage Regulator IC Positive Adjustable Output 1.5A SOT-223-4; DESCRIPTION: LDO VIN 1.25 to 37V SOT223; MFN: LM317AEMPX/NOPB; PART_VALUE: LM317
IC400 = Labops_Lib_AH:R7FA6M5BG3CFB; MFN: R7FA6M5BG3CFB#AA0; MFR: Renesas
IC401 = Labops_Lib_AH:CSTNE8M00G520000R0: 8.000MHz ±0.50% Ceramic Resonator with Built in Capacitor 10pF 40Ω Stability ±0.20% 3-SMD; DESCRIPTION: 8MHz ±0.5% 10pF 40Ω SMD3213-3P Ceramic Resonators; LIB_STATUS: Prototype; MFN: CSTNE8M00G520000R0; MFR: Murata; PART_VALUE: 8MHz, 0.5%; PRICE-1: 0.12; SUPPLIER-1: LCSC
IC500 = Labops_Lib_AH:SN65HVD3082EDR; DESCRIPTION: RS485 Transciever, 200Kbps, SOIC-8 , ALT: TP8485E-SR (3Peak); LIB_STATUS: Prototype; MFN: SN65HVD3082EDR; MFR: TI,3Peak; OUR_STOCK: 10; PART_VALUE: RS485 Driver; PRICE-1: 0.30; SUPPLIER-1: LCSC
K100 K101 = Labops_Lib_AH:PANASONIC_ALFG2PF09: Relay 31A, 9V, SPST-NO (1 Form A) Panasonic; CIIVA_IDS: 1180488; COIL_VOLTAGE: 9 V; COMPONENT_LINK_1_DESCRIPTION: Manufacturer URL; COMPONENT_LINK_1_URL: http://www3.panasonic.biz/ac/ae/index.jsp; COMPONENT_LINK_3_DESCRIPTION: Package Specification; COMPONENT_LINK_3_URL: http://www3.panasonic.biz/ac/e_download/control/relay/power/catalog/mech_eng_lfg.pdf?f_cd=300272; DATASHEET: http://www3.panasonic.biz/ac/e_download/control/relay/power/catalog/mech_eng_lfg.pdf?f_cd=300272; DATASHEET_VERSION: 201402-T; ELECTRICAL_LIFE: 3x10^4; FOOTPRINT_VARIANT_NAME_0: Manufacturer Recommended; IMPORTED: yes; IMPORTED_FROM: vault; IMPORT_TS: 1521844845; MAX_SWITCHING_CURRENT: 31 A AC; MAX_SWITCHING_VOLTAGE: 250 V AC; MECHANICAL_LIFEMINOPERATION: 1x10^6; MF: Panasonic; MOUNTING_TECHNOLOGY: Through Hole; MPN: ALFG2PF09; NOMINAL_OPERATING_POWER: 1400 mW; PACKAGE: LF-G-4-3010x1570x2330; PACKAGE_DESCRIPTION: 4-Pin Through Hole Terminal Package, Body 30.1 x 15.7 mm; PACKAGE_VERSION: ASCTB196E, 02/2014; PACKING: Carton, Case; PB__FREE: true; PREFIX: K; RELEASE_DATE: 1421744840; SERIES: LF-G Relays; VAULT_GUID: 49A0321D-630D-49EF-B2C8-0308632C255A; VAULT_REVISION: 10808CD6-6A28-402B-B998-FC10EF34438A
L300 L302 L304 L308 L309 = Labops_Lib_AH:BLM18RK601SN1D; DESCRIPTION: 600 Ohms @ 100 MHz 1 - Ferrite Bead 0603; LIB_STATUS: Prototype; MFN: BLM18RK601SN1D; MFR: Murata; OUR_STOCK: 100; PART_VALUE: 600R@100MHz; PRICE-1: 0.05; SUPPLIER-1: Digikey
L303 L307 = Labops_Lib_AH:SRN8040TA-220M: FIXED IND 22UH 2.9A SMD, 73m-Ohm, Bourns; DESCRIPTION: FIXED IND 22UH 2.9A SMD, 73m-Ohm, Bourns; LIB_STATUS: Verified; MFN: SRN8040TA-220M; MFR: Bourns; OUR_STOCK: 10; PART_VALUE: 22uH/2.9A; SUPPLIER-1: Digikey; TECHNOLOGY: SMD
Q100 = Labops_Lib_AH:BC640TA; DESCRIPTION: Bipolar (BJT) Transistor PNP 80 V 1 A 100MHz 1 W Through Hole TO-92-3; LIB_STATUS: Prototype; MFN: BC640TA; MFR: On Semi,; OUR_STOCK: 20; PART_VALUE: BC640TA; PRICE-1: 0.32; SUPPLIER-1: Digikey
Q101 = Labops_Lib_AH:KSD1616AYTA; DESCRIPTION: NPN 60 V 1 A 160MHz 750 mW Through Hole TO-92-3; LIB_STATUS: Prototype; MFN: KSD1616AYTA; MFR: On Semi; OUR_STOCK: 0; PART_VALUE: NPN; PRICE-1: 0.35; SUPPLIER-1: Digikey
Q300 Q306 T302 T307-T310 T313 T500-T502 = Labops_Lib_AH:2N7002; DESCRIPTION: NMOSFET, 500mA, 60V, Vth 2.5V; LIB_STATUS: Prototype; MFN: 2N7002; MFR: Diodes, Guangdong Hotetech,NXP; OUR_STOCK: 100; PART_VALUE: NMOSFET; PRICE-1: 0.02; SUPPLIER-1: LCSC
Q500 Q502 Q504 = Labops_Lib_AH:DMP6185SEQ-13: PMOSFET, SOT-223, 60V, 3A; DESRIPTION: PMOSFET 60V, 3A, SOT223; MFN: DMP6185SEQ-13; MFR: Diodes; OUR_STOCK: 100; PART_VALUE: DMP6185SEQ-13; PRICE-1: 0.18; SUPPLIER-1: LCSC
Q501 Q503 Q505-Q507 = Labops_Lib_AH:BC817; DESCRIPTION: Transistor BJT NPN SOT23 45V 0.5A; MFN: BC817; MFR: NXP; PRICE-1: 0.03; SUPPLIER-1: Mouser
R100 R112 = Labops_Lib_AH:B57364S100M54: NTC Inrush Current Limiter
R101 R103 = Labops_Lib_AH:R_1206; MFN: Open Source R1206
R102 R104 = Labops_Lib_AH:ERG-2SJ513; DESCRIPTION: RES 51K OHM 5% 2W AXIAL; MFN: ERG-2SJ513; MFR: Panasonic; PART_VALUE: 51K 3%
R105 = Labops_Lib_AH:R_2010; PRICE-1: 0.11; SUPPLIER-1: Digikey
R106 R107 R109 R110 R200 R201 R300 R303 R305-R308 R314 R315 R317-R321 R324 R333-R339 R341-R371 R373-R384 R386 R388-R391 R397 R399 R400 R402-R423 R425 R426 R428-R435 R437 R443-R452 R461-R463 R500-R528 = Labops_Lib_AH:R_0603; MFN: Open Source 0603
R108 R113 = Labops_Lib_AH:R_2010; MFN: Open Source R 2010; PART_VALUE: 18R 1%
R111 = Labops_Lib_AH:R_1206; MFN: Open Source R1206; PART_VALUE: 1K 1%
R114 R115 R326 R398 = Labops_Lib_AH:RNF12FTD10M0; DESCRIPTION: 10 MOhms ±1% 0.5W, 1/2W Through Hole Resistor Axial Flame Retardant Coating, Safety Metal Film; LIB_STATUS: Prototype; MFN: RNF12FTD10M0; MFR: Stackpole Electronics Inc; OUR-STOCK: 20; PART_VALUE: 10Meg 5%; PRICE-1: 0.29; SUPPLIER-1: Digikey
R301 R302 R310 R311 R322 R323 R329 R330 = rcl:R-US_: RESISTOR, American symbol; SPICEPREFIX: R
R304 R309 R312 R313 R325 R327 R328 R331 R332 R385 R387 R396 R436 R438 = Labops_Lib_AH:R_2010; MFN: Open Source R 2010
R316 R372 R401 R424 R427 = Labops_Lib_AH:R_2512
R340 = Labops_Lib_AH:WSL5931L3000FEA; DESCRIPTION: 300 µOhms ±1% 5W Chip Resistor Nonstandard Anti-Sulfur, Automotive AEC-Q200, Current Sense, Moisture Resistant, Pulse Withstanding Metal Element; LIB_STATUS: Verified; MFN: WSL5931L3000FEA; MFR: Vishay; OUR_STOCK: 5; PART_VALUE: 300uR 1% 5W; PRICE-1: 2.1; SUPPLIER-1: Digikey
R439-R442 = Labops_Lib_AH:RR02J22RTB; DESCRIPTION: 22R,5%,2W, THT, 15mm pitch; MFN: RR02J22RTB; MFR: TE Connectivity; PRICE-1: 0.4
T300 T301 T303 T304 = Labops_Lib_AH:IHW20N120R5; DESCRIPTION: IGBT 20A 1200V TO247; MFN: IHW20N120R5; MFR: Infineon; PACKAGE: TO247-AC; PART_VALUE: IHW20N120R5
TR300 = Labops_Lib_AH:CST206-2A: Current sense transformer, Iprim_max=80A RMS. 20-200KHz, Triag Magnetics; DESCRIPTION: Transformer; Current Sense; Config Encapsulated; 1; Freq 20-200kHz; Pri 80A; PCB; LIB_STATUS: verified; MFN: CST206-2A; MFR: Trriad Magnetics; OUR_STOCK: 8; PART_VALUE: 1:200, 80A; PRICE-1: 5.5; SUPPLIER-1: Digikey
TR305 = Labops_Lib_AH:11-0060-A; DESCRIPTION: 4KW Full Bridge Transformer, THT; MFN: 11-0060-A; MFR: Dongguan Speed Electronics
U300 U301 = Labops_Lib_AH:PAD_3MMX6MM; DESCRIPTION: PAD 3mm x 6mm; MFN: PCB PAD 3mm x 6mm; MFR: NA; PART_VALUE: PAD 3mmx6mm
V100 V300 = Labops_Lib_AH:B72205S0271K101: VARISTOR 205V 800A DISC 5MM; LIB_STATUS: Verified; MFN: B72205S0271K1011; MFR: EPCOS; OUR_STOCK: 10; PART_VALUE: 430V, 400A; PRICE-1: 0.31; SUPPLIER-1: Digikey
V400-V402 V500-V504 = Labops_Lib_AH:0603ESDA-24N; DESCRIPTION: aristor 0603 SMD Bidirectional 50V 24V; MFN: 0603ESDA-24N; MFR: Bourns; SUPPLIER-1: LCSC
X1 X3 X200-X203 = Labops_Lib_AH:726386-2: Terminals, Faston, GDS-Flachstecker 6.3x0.8mm, TE; CENTROID_NOT_SPECIFIED: No; CONN_GENDER: Male; CONN_ORIENTATION: Straight; CONTACT_MATERIAL: Tin; DATASHEET: http://www.te.com/commerce/DocumentDelivery/DDEController?Action=showdoc&DocId=Customer+Drawing%7F726386%7FG%7Fpdf%7FEnglish%7FENG_CD_726386_G.pdf%7F726386-2; DEVICE_CLASS_L1: Connectors; DEVICE_CLASS_L2: Terminal Blocks | Terminals; DEVICE_CLASS_L3: unset; DIGIKEY_DESCRIPTION: CONN QC TAB 0.250 SOLDER; DIGIKEY_PART_NUMBER: A114371-ND; HEIGHT: 10mm; LEAD_FREE: yes; MF: TE; MFG_PACKAGE_IDENT: 726386-2; MFG_PACKAGE_IDENT_DATE: 0; MFG_PACKAGE_IDENT_REV: 0; MOUSER_DESCRIPTION: Terminals GDS-FLACHSTECK 6.3; MOUSER_PART_NUMBER: 571-726386-2; MPN: 726386-2; PACKAGE: PTH_TERMINAL_8MM0_0MM8; PREFIX: J; ROHS: yes; TEMPERATURE_RANGE_HIGH: +110°C; TEMPERATURE_RANGE_LOW: -30°C; VERIFICATION_VERSION: 0.0.0.1
X2 X4 = Labops_Lib_AH:7461061: Pin Screw Terminal, Power Tap M10 Through Hole, Pressfit, Redcube series
X5 X6 = Labops_Lib_AH:615008148521: WR-MJ Modular Jack Horizontal Plastic 8P8C Tab Up KIND PROPERTIES Quality Class:500 Mating cycles General Information Operating Temperature:-40 up to +85 °C Compliance: RoHS Electrical Properties IR 1:1.5A Working Voltage:120V (AC) Withstanding Voltage:1000V (AC) Contact Resistance:20mΩ RISO:500 MΩ Material Properties Insulator MateriaL:PBT Insulator Flammability Rating:UL94 V-0 Color:Black Contact Material Copper Alloy Contact Plating:Gold Contact Type:Stamped Packaging Properties Packaging:Tray <https://www.we-online.com/catalog/media/o76656v209%20Family_WR-MJ_Plastic_Horizontal_Tab-UP_615008148521.jpg> Details see: https://www.we-online.com/catalog/en/MJ_HORIZONTAL_PLASTIC_8P8C_TAB_UP/ Updated by Yingchun,Shan 2020-01-06 2020 (C) Würth Elektronik; DESCRIPTION: RJ45 unshielded 8P8C; MFN: 615008148521; MFR: Wurth Elektronik; PART_VALUE: 615008148521; TYPE: Horizontal
X7 X8 X400-X402 = Labops_Lib_AH:2304-6111-TP; DESCRIPTION: 4 Pin THT Connector 100 mil pitch; MFN: 2304-6111-TP; MFR: 3M; PART_VALUE: X04 Connector 100mil
X100 X101 = Labops_Lib_AH:01020071Z; DESCRIPTION: Fuse Clip, 1/4" Fuses, Littlefuse, THT; MFN: 01020071Z; MFR: LittleFuse
X204 X205 = Labops_Lib_AH:MOLEX_206832-0601: Connector Header Through Hole 6 position 0.118" (3.00mm); DESCRIPTION: Connector Header Through Hole 6 position 3mm Microfit; LIB_STATUS: Prototype; MFN: 206832-0601; MFR: Molex; OUR_STOCK: 20; PART_VALUE: 6CCT x 2Row; PRICE-1: 1.32; SUPPLIER-1: Digikey
X403 = Labops_Lib_AH:WF2549-2WS05S0B01; DESCRIPTION: X10, 10 Pins, Header, Pitch 2.54 wire to board 2xrows, THT; MFN: WF2549-2WS05S0B01; MFR: WCON; PRICE-1: 0.25; SUPPLIER-1: LCSC